# EAGLE design AnalogConversion_v1 (EAGLE 9.6.2)

## Sheet 1 of 6: MAIN
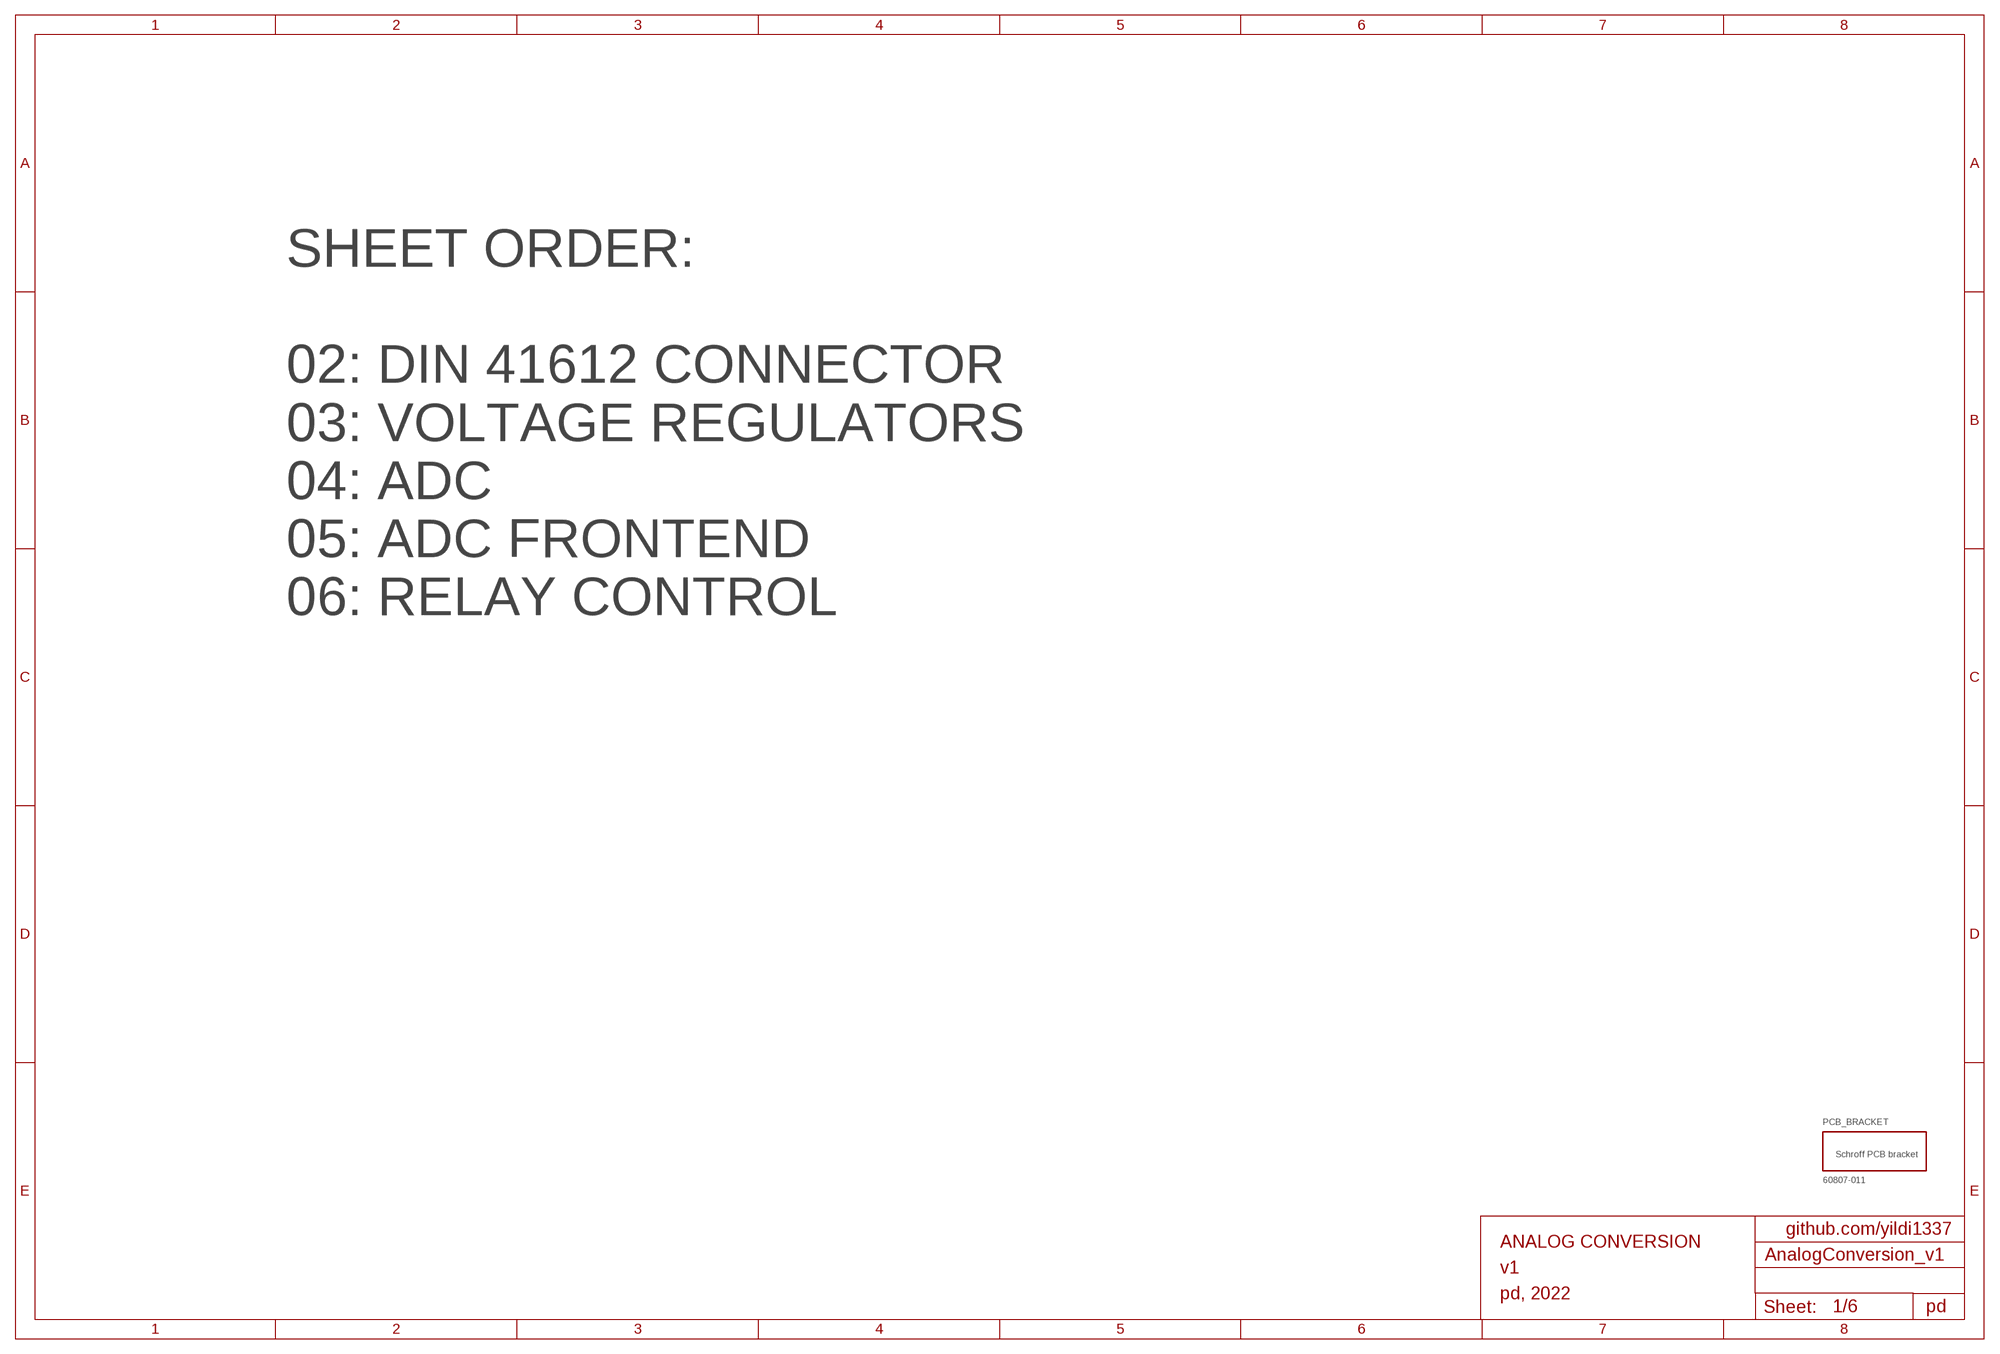
[diagram p0: schematic, sheet 1]

### Parts
PCB_BRACKET  60807-011  [60807-011]

### Notes on the sheet
- SHEET ORDER:
  
  02: DIN 41612 CONNECTOR
  03: VOLTAGE REGULATORS
  04: ADC
  05: ADC FRONTEND
  06: RELAY CONTROL
- github.com/yildi1337
- ANALOG CONVERSION
- v1
- pd, 2022
- pd

## Sheet 2 of 6: DIN 41612 CONNECTOR
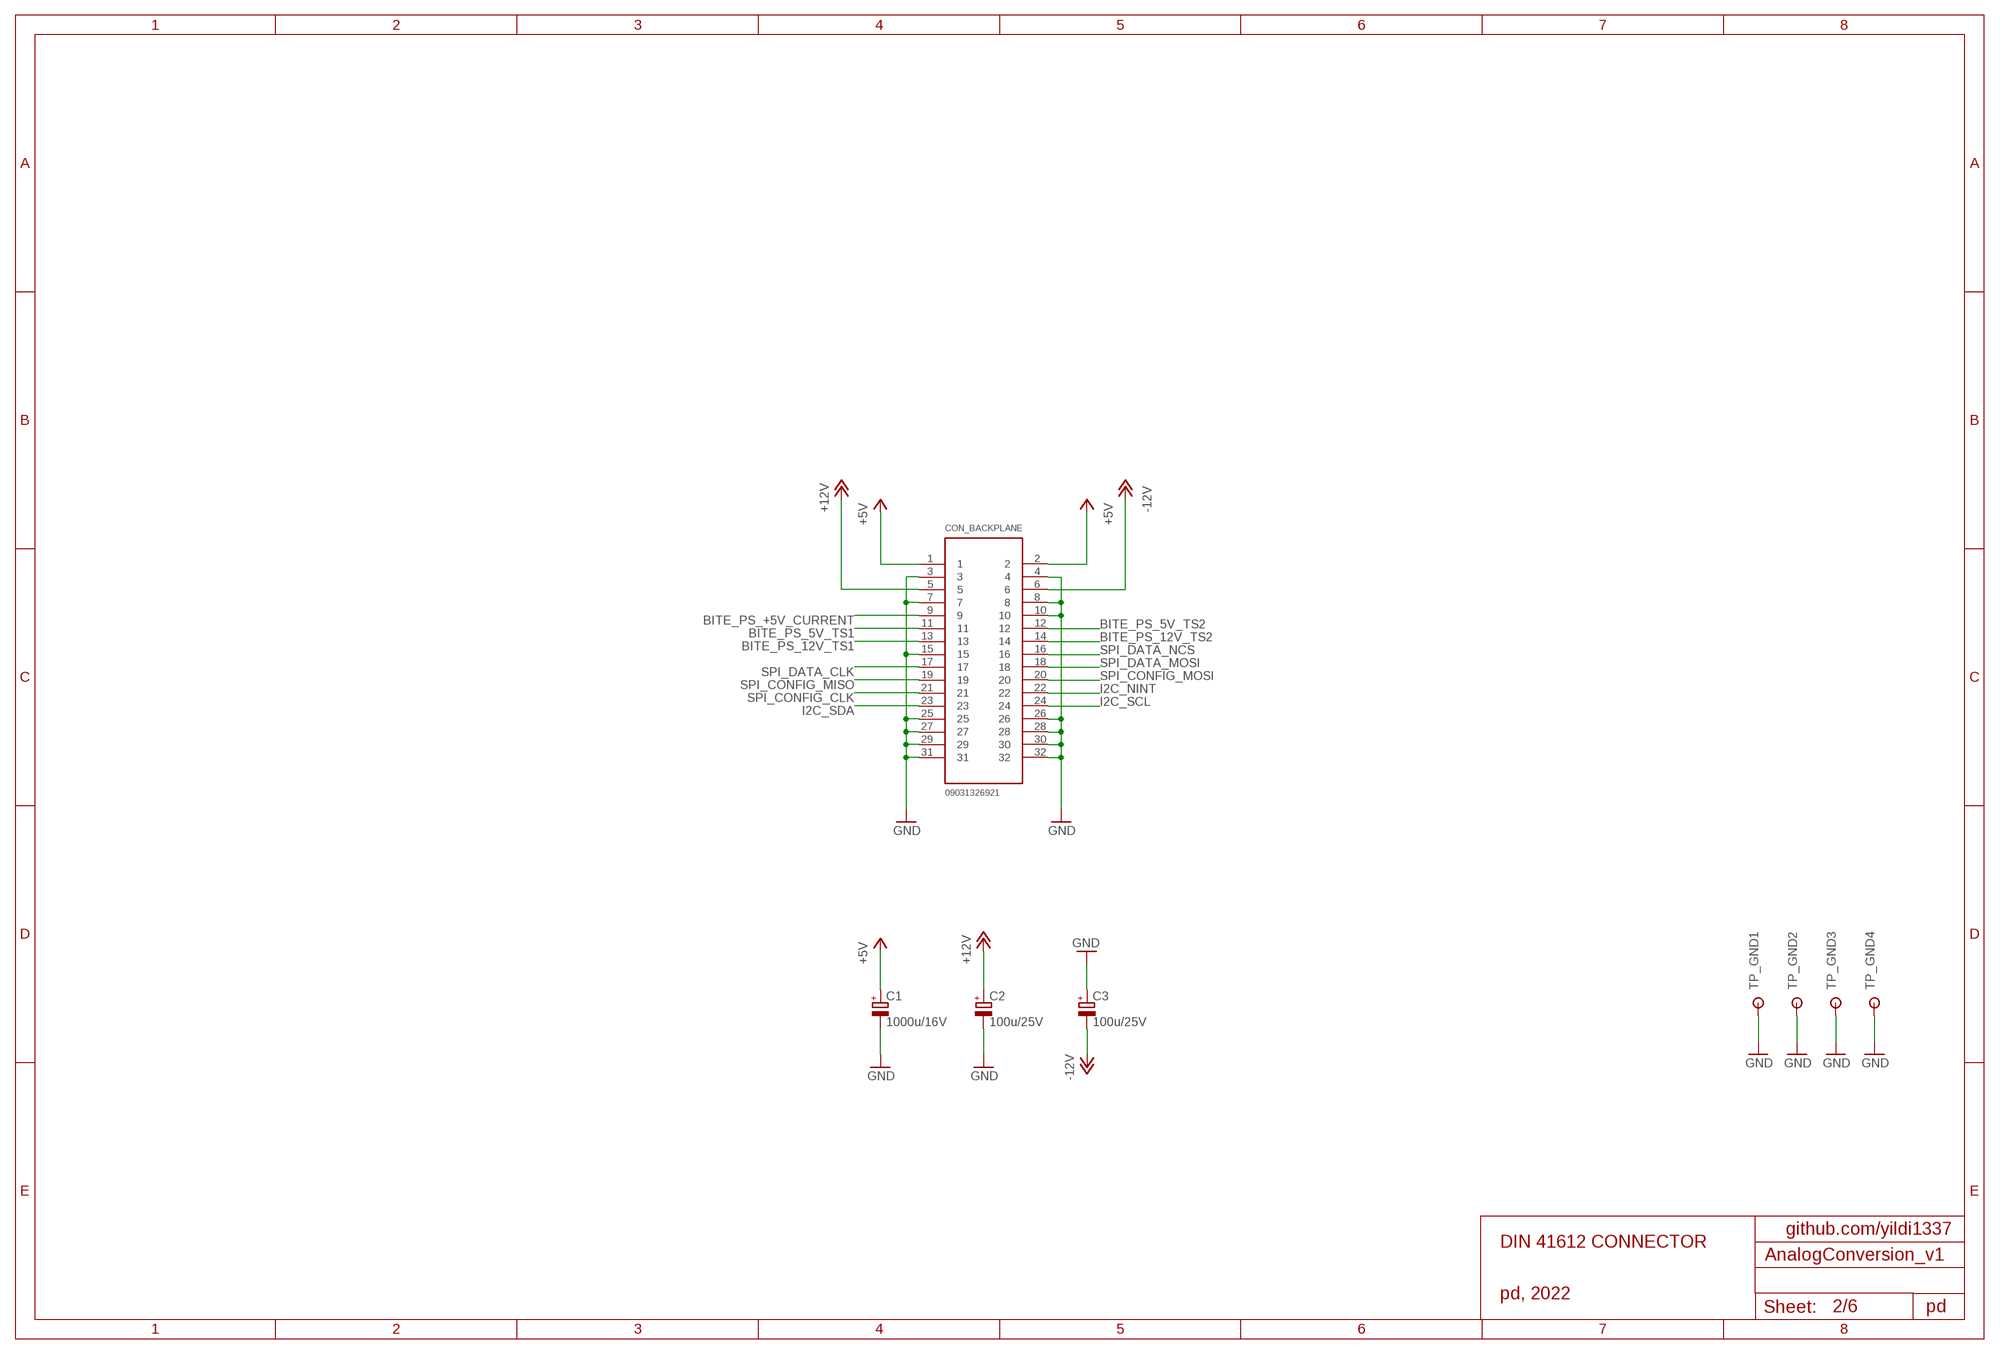
[diagram p1: schematic, sheet 2]

### Parts
C1  1000u/16V  CPOL-EU153CLV-1010  [153CLV-1010]
C2  100u/25V  CPOL-EU153CLV-0810  [153CLV-0810]
C3  100u/25V  CPOL-EU153CLV-0810  [153CLV-0810]
CON_BACKPLANE  09031326921  [09031326921]
TP_GND1  RSPRO-1MM-TERMINAL-POST-2622034  [RSPRO-1MM-TERMINAL-POST-2622034]
TP_GND2  RSPRO-1MM-TERMINAL-POST-2622034  [RSPRO-1MM-TERMINAL-POST-2622034]
TP_GND3  RSPRO-1MM-TERMINAL-POST-2622034  [RSPRO-1MM-TERMINAL-POST-2622034]
TP_GND4  RSPRO-1MM-TERMINAL-POST-2622034  [RSPRO-1MM-TERMINAL-POST-2622034]

### Nets
+5V: C1.+ CON_BACKPLANE.1 CON_BACKPLANE.2 ; also sheet 3,5,6
+12V: C2.+ CON_BACKPLANE.5 ; also sheet 3
-12V: C3.- CON_BACKPLANE.6 ; also sheet 3
BITE_PS_5V_TS1: CON_BACKPLANE.11
BITE_PS_5V_TS2: CON_BACKPLANE.12
BITE_PS_12V_TS1: CON_BACKPLANE.13
BITE_PS_12V_TS2: CON_BACKPLANE.14
BITE_PS_+5V_CURRENT: CON_BACKPLANE.9
GND: C1.- C2.- C3.+ CON_BACKPLANE.3 CON_BACKPLANE.4 CON_BACKPLANE.7 CON_BACKPLANE.8 CON_BACKPLANE.10 CON_BACKPLANE.15 CON_BACKPLANE.25 CON_BACKPLANE.26 CON_BACKPLANE.27 CON_BACKPLANE.28 CON_BACKPLANE.29 CON_BACKPLANE.30 CON_BACKPLANE.31 CON_BACKPLANE.32 TP_GND1.P$1 TP_GND2.P$1 TP_GND3.P$1 TP_GND4.P$1 ; also sheet 3,4,5,6
I2C_NINT: CON_BACKPLANE.22 ; also sheet 6
I2C_SCL: CON_BACKPLANE.24 ; also sheet 6
I2C_SDA: CON_BACKPLANE.23 ; also sheet 6
SPI_CONFIG_CLK: CON_BACKPLANE.21 ; also sheet 4,6
SPI_CONFIG_MISO: CON_BACKPLANE.19 ; also sheet 4,6
SPI_CONFIG_MOSI: CON_BACKPLANE.20 ; also sheet 4,6
SPI_DATA_CLK: CON_BACKPLANE.17 ; also sheet 4
SPI_DATA_MOSI: CON_BACKPLANE.18 ; also sheet 4
SPI_DATA_NCS: CON_BACKPLANE.16 ; also sheet 4

### Notes on the sheet
- github.com/yildi1337
- DIN 41612 CONNECTOR
- pd, 2022
- pd

## Sheet 3 of 6: VOLTAGE REGULATORS
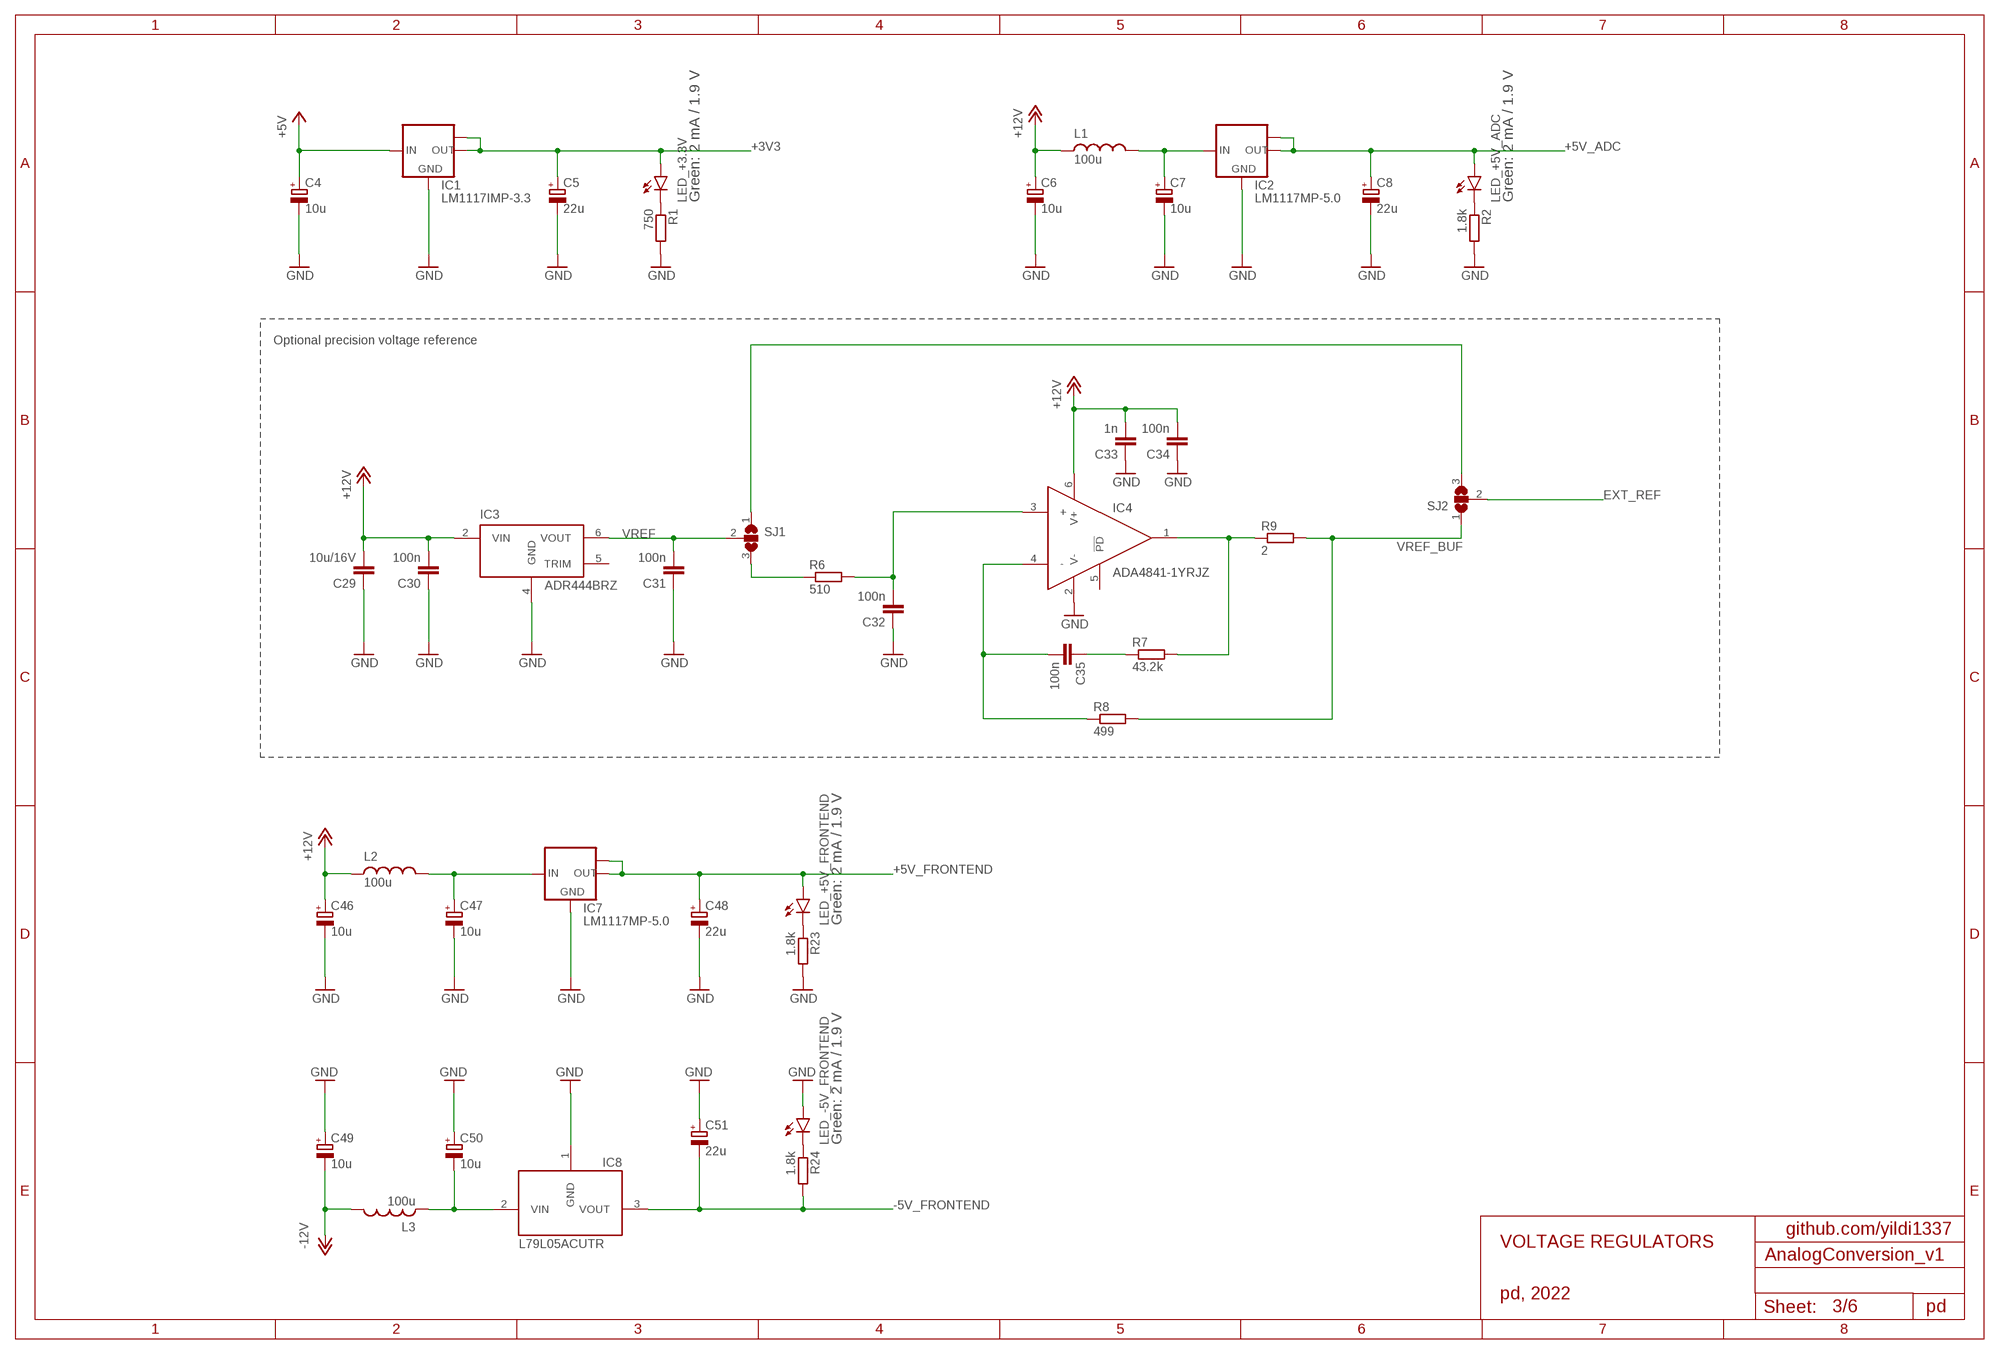
[diagram p2: schematic, sheet 3]

### Parts
C4  10u  CPOL-EUCT3216  [CT3216]
C5  22u  CPOL-EUCT6032  [CT6032]
C6  10u  CPOL-EUCT3216  [CT3216]
C7  10u  CPOL-EUCT3216  [CT3216]
C8  22u  CPOL-EUCT6032  [CT6032]
C29  10u/16V  C-EUC0805  [C0805]
C30  100n  C-EUC0603  [C0603]
C31  100n  C-EUC0603  [C0603]
C32  100n  C-EUC0603  [C0603]
C33  1n  C-EUC0603  [C0603]
C34  100n  C-EUC0603  [C0603]
C35  100n  C-EUC0603  [C0603]
C46  10u  CPOL-EUCT3216  [CT3216]
C47  10u  CPOL-EUCT3216  [CT3216]
C48  22u  CPOL-EUCT6032  [CT6032]
C49  10u  CPOL-EUCT3216  [CT3216]
C50  10u  CPOL-EUCT3216  [CT3216]
C51  22u  CPOL-EUCT6032  [CT6032]
IC1  LM1117IMP-3.3  LM1117IMPX-3.3  [SOT223]
IC2  LM1117MP-5.0  LM1117MPX-5.0  [SOT223]
IC3  ADR444BRZ  [ADR444BRZ]
IC4  ADA4841-1YRJZ  [ADA4841-1YRJZ]
IC7  LM1117MP-5.0  LM1117MPX-5.0  [SOT223]
IC8  L79L05ACUTR  [L79L05ACUTR]
L1  100u  VLS6045AF-101M  [VLS6045AF-101M]
L2  100u  VLS6045AF-101M  [VLS6045AF-101M]
L3  100u  VLS6045AF-101M  [VLS6045AF-101M]
LED_+3.3V  LEDCHIP-LED0603  [CHIP-LED0603]
LED_+5V_ADC  LEDCHIP-LED0603  [CHIP-LED0603]
LED_+5V_FRONTEND  LEDCHIP-LED0603  [CHIP-LED0603]
LED_-5V_FRONTEND  LEDCHIP-LED0603  [CHIP-LED0603]
R1  750  R-EU_R0603  [R0603]
R2  1.8k  R-EU_R0603  [R0603]
R6  510  R-EU_R0603  [R0603]
R7  43.2k  R-EU_R0603  [R0603]
R8  499  R-EU_R0603  [R0603]
R9  2  R-EU_R0603  [R0603]
R23  1.8k  R-EU_R0603  [R0603]
R24  1.8k  R-EU_R0603  [R0603]
SJ1  SJ2W  [SJ_2]
SJ2  SJ2W  [SJ_2]

### Nets
+3V3: C5.+ IC1.2(OUT) IC1.TAB(OUT1) LED_+3.3V.A ; also sheet 4,6
+5V: C4.+ IC1.3(IN) ; also sheet 2,5,6
+5V_ADC: C8.+ IC2.2(OUT) IC2.TAB(OUT1) LED_+5V_ADC.A ; also sheet 4
+5V_FRONTEND: C48.+ IC7.2(OUT) IC7.TAB(OUT1) LED_+5V_FRONTEND.A ; also sheet 5
+12V: C6.+ C29.2 C30.2 C33.2 C34.2 C46.+ IC3.2(VIN) IC4.6(V+) L1.1 L2.1 ; also sheet 2
-5V_FRONTEND: C51.- IC8.3(VOUT) R24.2 ; also sheet 5
-12V: C49.- L3.2 ; also sheet 2
EXT_REF: SJ2.2 ; also sheet 4
GND: C4.- C5.- C6.- C7.- C8.- C29.1 C30.1 C31.1 C32.1 C33.1 C34.1 C46.- C47.- C48.- C49.+ C50.+ C51.+ IC1.1(GND) IC2.1(GND) IC3.4(GND) IC4.2(V-) IC7.1(GND) IC8.1(GND) LED_-5V_FRONTEND.A R1.2 R2.2 R23.2 ; also sheet 2,4,5,6
N$1: R6.1 SJ1.3
N$2: C32.2 IC4.3(+) R6.2
N$3: IC4.1(VOUT) R7.2 R9.1
N$4: C7.+ IC2.3(IN) L1.2
N$5: SJ1.1 SJ2.3
N$6: C35.1 R7.1
N$7: C35.2 IC4.4(-) R8.1
N$12: LED_+5V_FRONTEND.C R23.1
N$13: C47.+ IC7.3(IN) L2.2
N$15: C50.- IC8.2(VIN) L3.1
N$23: LED_-5V_FRONTEND.C R24.1
N$49: LED_+3.3V.C R1.1
N$50: LED_+5V_ADC.C R2.1
VREF: C31.2 IC3.6(VOUT) SJ1.2
VREF_BUF: R8.2 R9.2 SJ2.1
Unconnected: IC3.5(TRIM) IC4.5(!PD)

### Notes on the sheet
- Green: 2 mA / 1.9 V | Green: 2 mA / 1.9 V
- Optional precision voltage reference
- Green: 2 mA / 1.9 V
- Green: 2 mA / 1.9 V
- github.com/yildi1337
- VOLTAGE REGULATORS
- pd, 2022
- pd

## Sheet 4 of 6: ADC
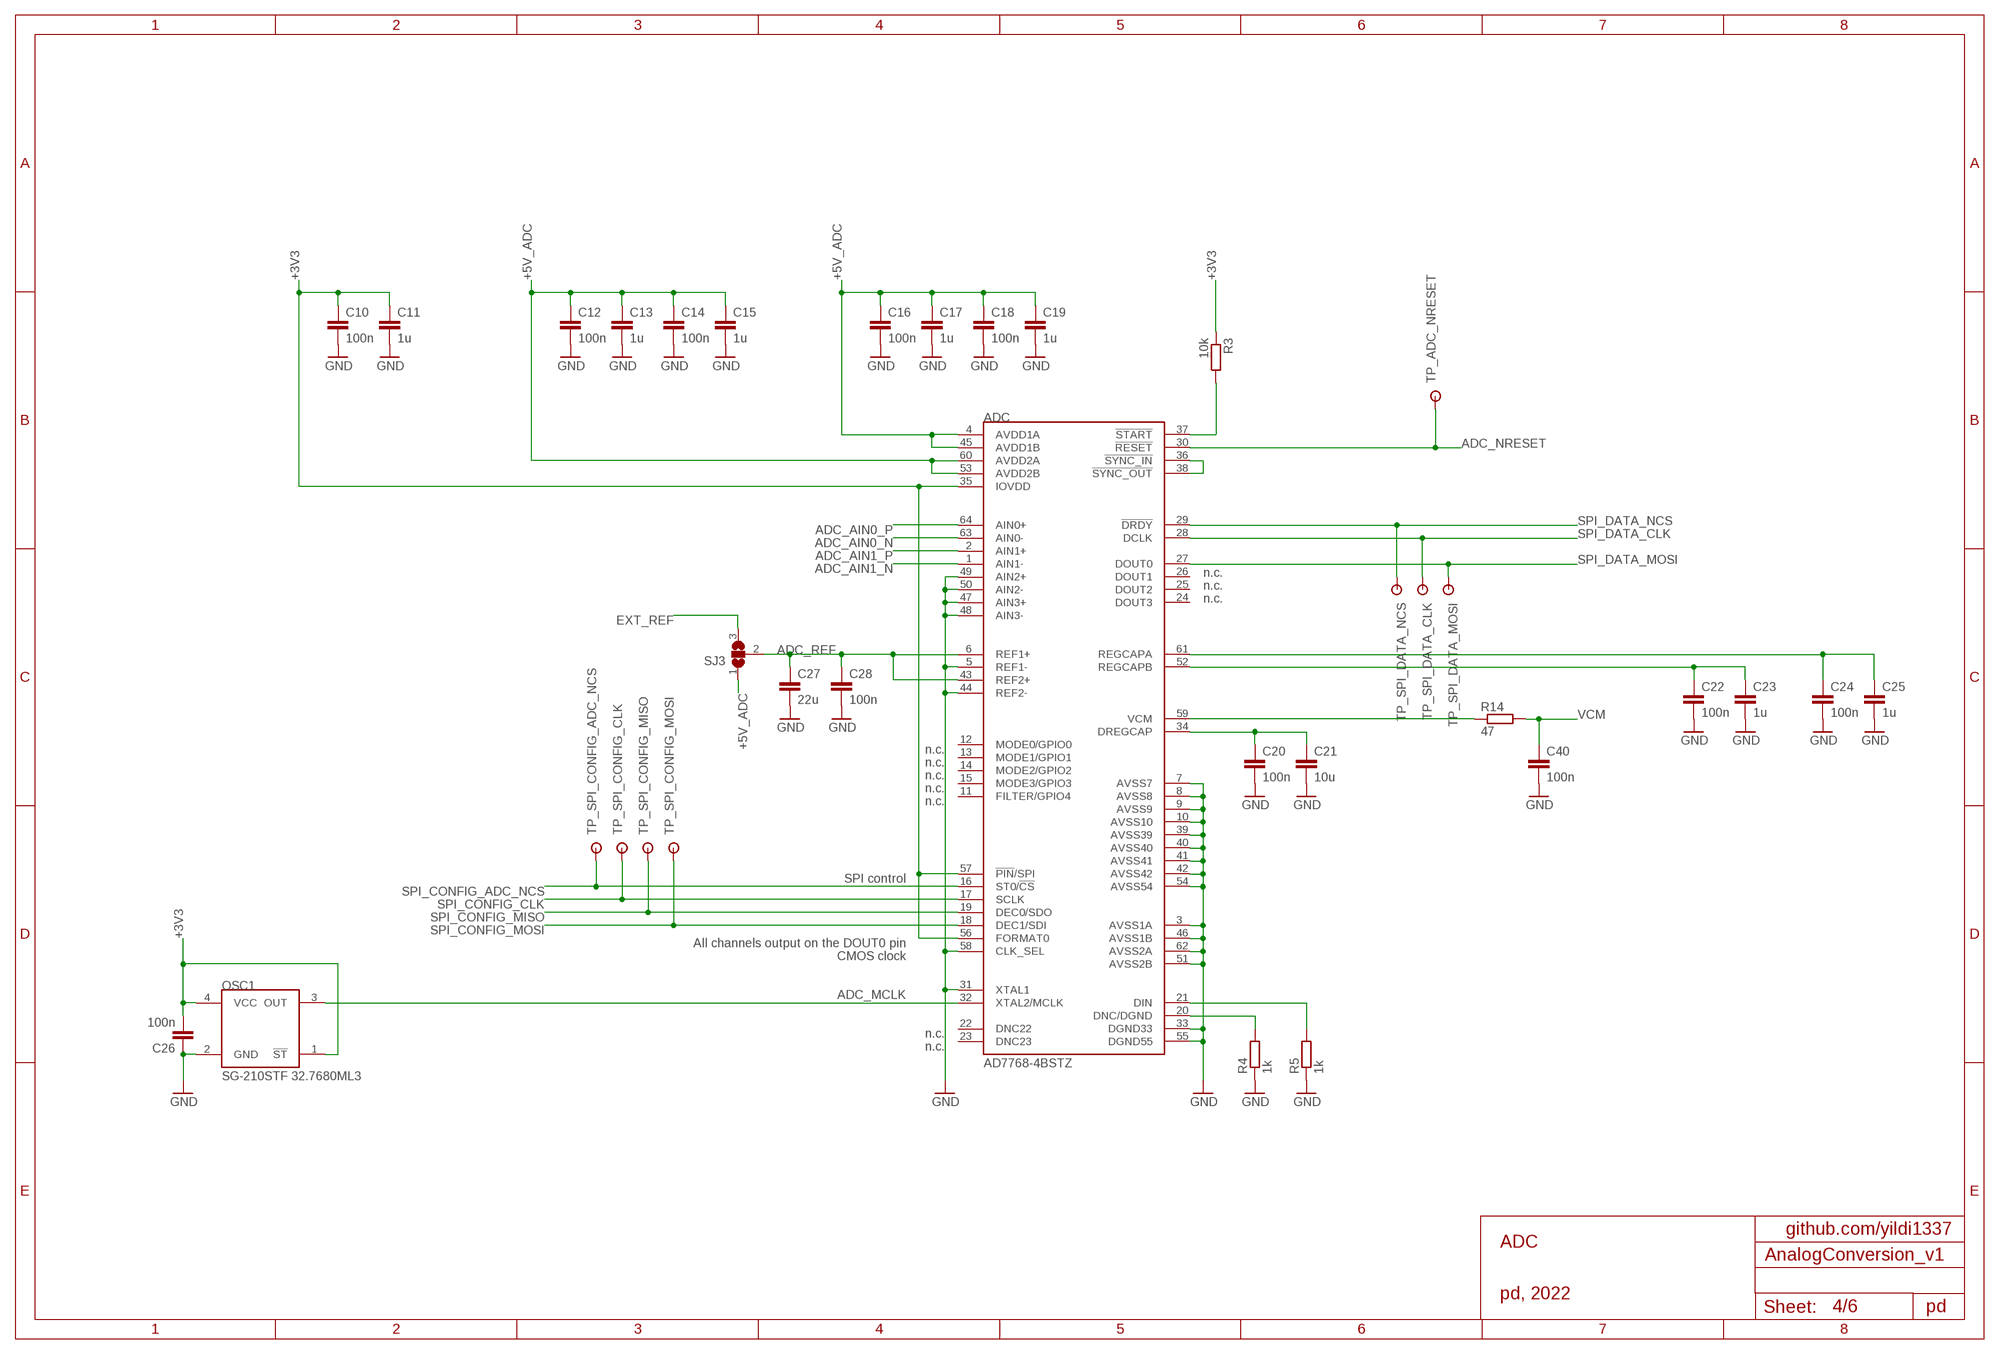
[diagram p3: schematic, sheet 4]

### Parts
ADC  AD7768-4BSTZ  [AD7768-4BSTZ]
C10  100n  C-EUC0603  [C0603]
C11  1u  C-EUC0603  [C0603]
C12  100n  C-EUC0603  [C0603]
C13  1u  C-EUC0603  [C0603]
C14  100n  C-EUC0603  [C0603]
C15  1u  C-EUC0603  [C0603]
C16  100n  C-EUC0603  [C0603]
C17  1u  C-EUC0603  [C0603]
C18  100n  C-EUC0603  [C0603]
C19  1u  C-EUC0603  [C0603]
C20  100n  C-EUC0603  [C0603]
C21  10u  C-EUC0603  [C0603]
C22  100n  C-EUC0603  [C0603]
C23  1u  C-EUC0603  [C0603]
C24  100n  C-EUC0603  [C0603]
C25  1u  C-EUC0603  [C0603]
C26  100n  C-EUC0603  [C0603]
C27  22u  C-EUC1206  [C1206]
C28  100n  C-EUC0603  [C0603]
C40  100n  C-EUC0603  [C0603]
OSC1  SG-210STF 32.7680ML3  SG-210STF-32.7680ML3  [SG-210STF-32.7680ML3]
R3  10k  R-EU_R0603  [R0603]
R4  1k  R-EU_R0603  [R0603]
R5  1k  R-EU_R0603  [R0603]
R14  47  R-EU_R0603  [R0603]
SJ3  SJ2W  [SJ_2]
TP_ADC_NRESET  RSPRO-1MM-TERMINAL-POST-2622034  [RSPRO-1MM-TERMINAL-POST-2622034]
TP_SPI_CONFIG_ADC_NCS  RSPRO-1MM-TERMINAL-POST-2622034  [RSPRO-1MM-TERMINAL-POST-2622034]
TP_SPI_CONFIG_CLK  RSPRO-1MM-TERMINAL-POST-2622034  [RSPRO-1MM-TERMINAL-POST-2622034]
TP_SPI_CONFIG_MISO  RSPRO-1MM-TERMINAL-POST-2622034  [RSPRO-1MM-TERMINAL-POST-2622034]
TP_SPI_CONFIG_MOSI  RSPRO-1MM-TERMINAL-POST-2622034  [RSPRO-1MM-TERMINAL-POST-2622034]
TP_SPI_DATA_CLK  RSPRO-1MM-TERMINAL-POST-2622034  [RSPRO-1MM-TERMINAL-POST-2622034]
TP_SPI_DATA_MOSI  RSPRO-1MM-TERMINAL-POST-2622034  [RSPRO-1MM-TERMINAL-POST-2622034]
TP_SPI_DATA_NCS  RSPRO-1MM-TERMINAL-POST-2622034  [RSPRO-1MM-TERMINAL-POST-2622034]

### Nets
+3V3: ADC.35(IOVDD) ADC.56(FORMAT0) ADC.57(!PIN!/SPI) C10.1 C11.1 C26.2 OSC1.1(!ST) OSC1.4(VCC) R3.1 ; also sheet 3,6
+5V_ADC: ADC.4(AVDD1A) ADC.45(AVDD1B) ADC.53(AVDD2B) ADC.60(AVDD2A) C12.1 C13.1 C14.1 C15.1 C16.1 C17.1 C18.1 C19.1 SJ3.1 ; also sheet 3
ADC_AIN0_N: ADC.63(AIN0-) ; also sheet 5
ADC_AIN0_P: ADC.64(AIN0+) ; also sheet 5
ADC_AIN1_N: ADC.1(AIN1-) ; also sheet 5
ADC_AIN1_P: ADC.2(AIN1+) ; also sheet 5
ADC_MCLK: ADC.32(XTAL2/MCLK) OSC1.3(OUT)
ADC_NRESET: ADC.30(!RESET!) TP_ADC_NRESET.P$1 ; also sheet 6
ADC_REF: ADC.6(REF1+) ADC.43(REF2+) C27.1 C28.1 SJ3.2
DIN: ADC.21(DIN) R5.2
DREGCAP: ADC.34(DREGCAP) C20.1 C21.1
EXT_REF: SJ3.3 ; also sheet 3
GND: ADC.3(AVSS1A) ADC.5(REF1-) ADC.7(AVSS7) ADC.8(AVSS8) ADC.9(AVSS9) ADC.10(AVSS10) ADC.31(XTAL1) ADC.33(DGND33) ADC.39(AVSS39) ADC.40(AVSS40) ADC.41(AVSS41) ADC.42(AVSS42) ADC.44(REF2-) ADC.46(AVSS1B) ADC.47(AIN3+) ADC.48(AIN3-) ADC.49(AIN2+) ADC.50(AIN2-) ADC.51(AVSS2B) ADC.54(AVSS54) ADC.55(DGND55) ADC.58(CLK_SEL) ADC.62(AVSS2A) C10.2 C11.2 C12.2 C13.2 C14.2 C15.2 C16.2 C17.2 C18.2 C19.2 C20.2 C21.2 C22.2 C23.2 C24.2 C25.2 C26.1 C27.2 C28.2 C40.2 OSC1.2(GND) R4.1 R5.1 ; also sheet 2,3,5,6
N$11: ADC.59(VCM) R14.1
N$48: ADC.20(DNC/DGND) R4.2
N$78: ADC.36(!SYNC_IN!) ADC.38(!SYNC_OUT!)
N$81: ADC.37(!START!) R3.2
REGCAPA: ADC.61(REGCAPA) C24.1 C25.1
REGCAPB: ADC.52(REGCAPB) C22.1 C23.1
SPI_CONFIG_ADC_NCS: ADC.16(ST0/!CS!) TP_SPI_CONFIG_ADC_NCS.P$1 ; also sheet 6
SPI_CONFIG_CLK: ADC.17(SCLK) TP_SPI_CONFIG_CLK.P$1 ; also sheet 2,6
SPI_CONFIG_MISO: ADC.19(DEC0/SDO) TP_SPI_CONFIG_MISO.P$1 ; also sheet 2,6
SPI_CONFIG_MOSI: ADC.18(DEC1/SDI) TP_SPI_CONFIG_MOSI.P$1 ; also sheet 2,6
SPI_DATA_CLK: ADC.28(DCLK) TP_SPI_DATA_CLK.P$1 ; also sheet 2
SPI_DATA_MOSI: ADC.27(DOUT0) TP_SPI_DATA_MOSI.P$1 ; also sheet 2
SPI_DATA_NCS: ADC.29(!DRDY!) TP_SPI_DATA_NCS.P$1 ; also sheet 2
VCM: C40.1 R14.2 ; also sheet 5
Unconnected: ADC.11(FILTER/GPIO4) ADC.12(MODE0/GPIO0) ADC.13(MODE1/GPIO1) ADC.14(MODE2/GPIO2) ADC.15(MODE3/GPIO3) ADC.22(DNC22) ADC.23(DNC23) ADC.24(DOUT3) ADC.25(DOUT2) ADC.26(DOUT1)

### Notes on the sheet
- n.c.
- n.c.
- n.c.
- n.c.
- n.c.
- n.c.
- n.c.
- n.c.
- SPI control
- All channels output on the DOUT0 pin
- CMOS clock
- n.c.
- n.c.
- github.com/yildi1337
- ADC
- pd, 2022
- pd

## Sheet 5 of 6: ADC FRONTEND
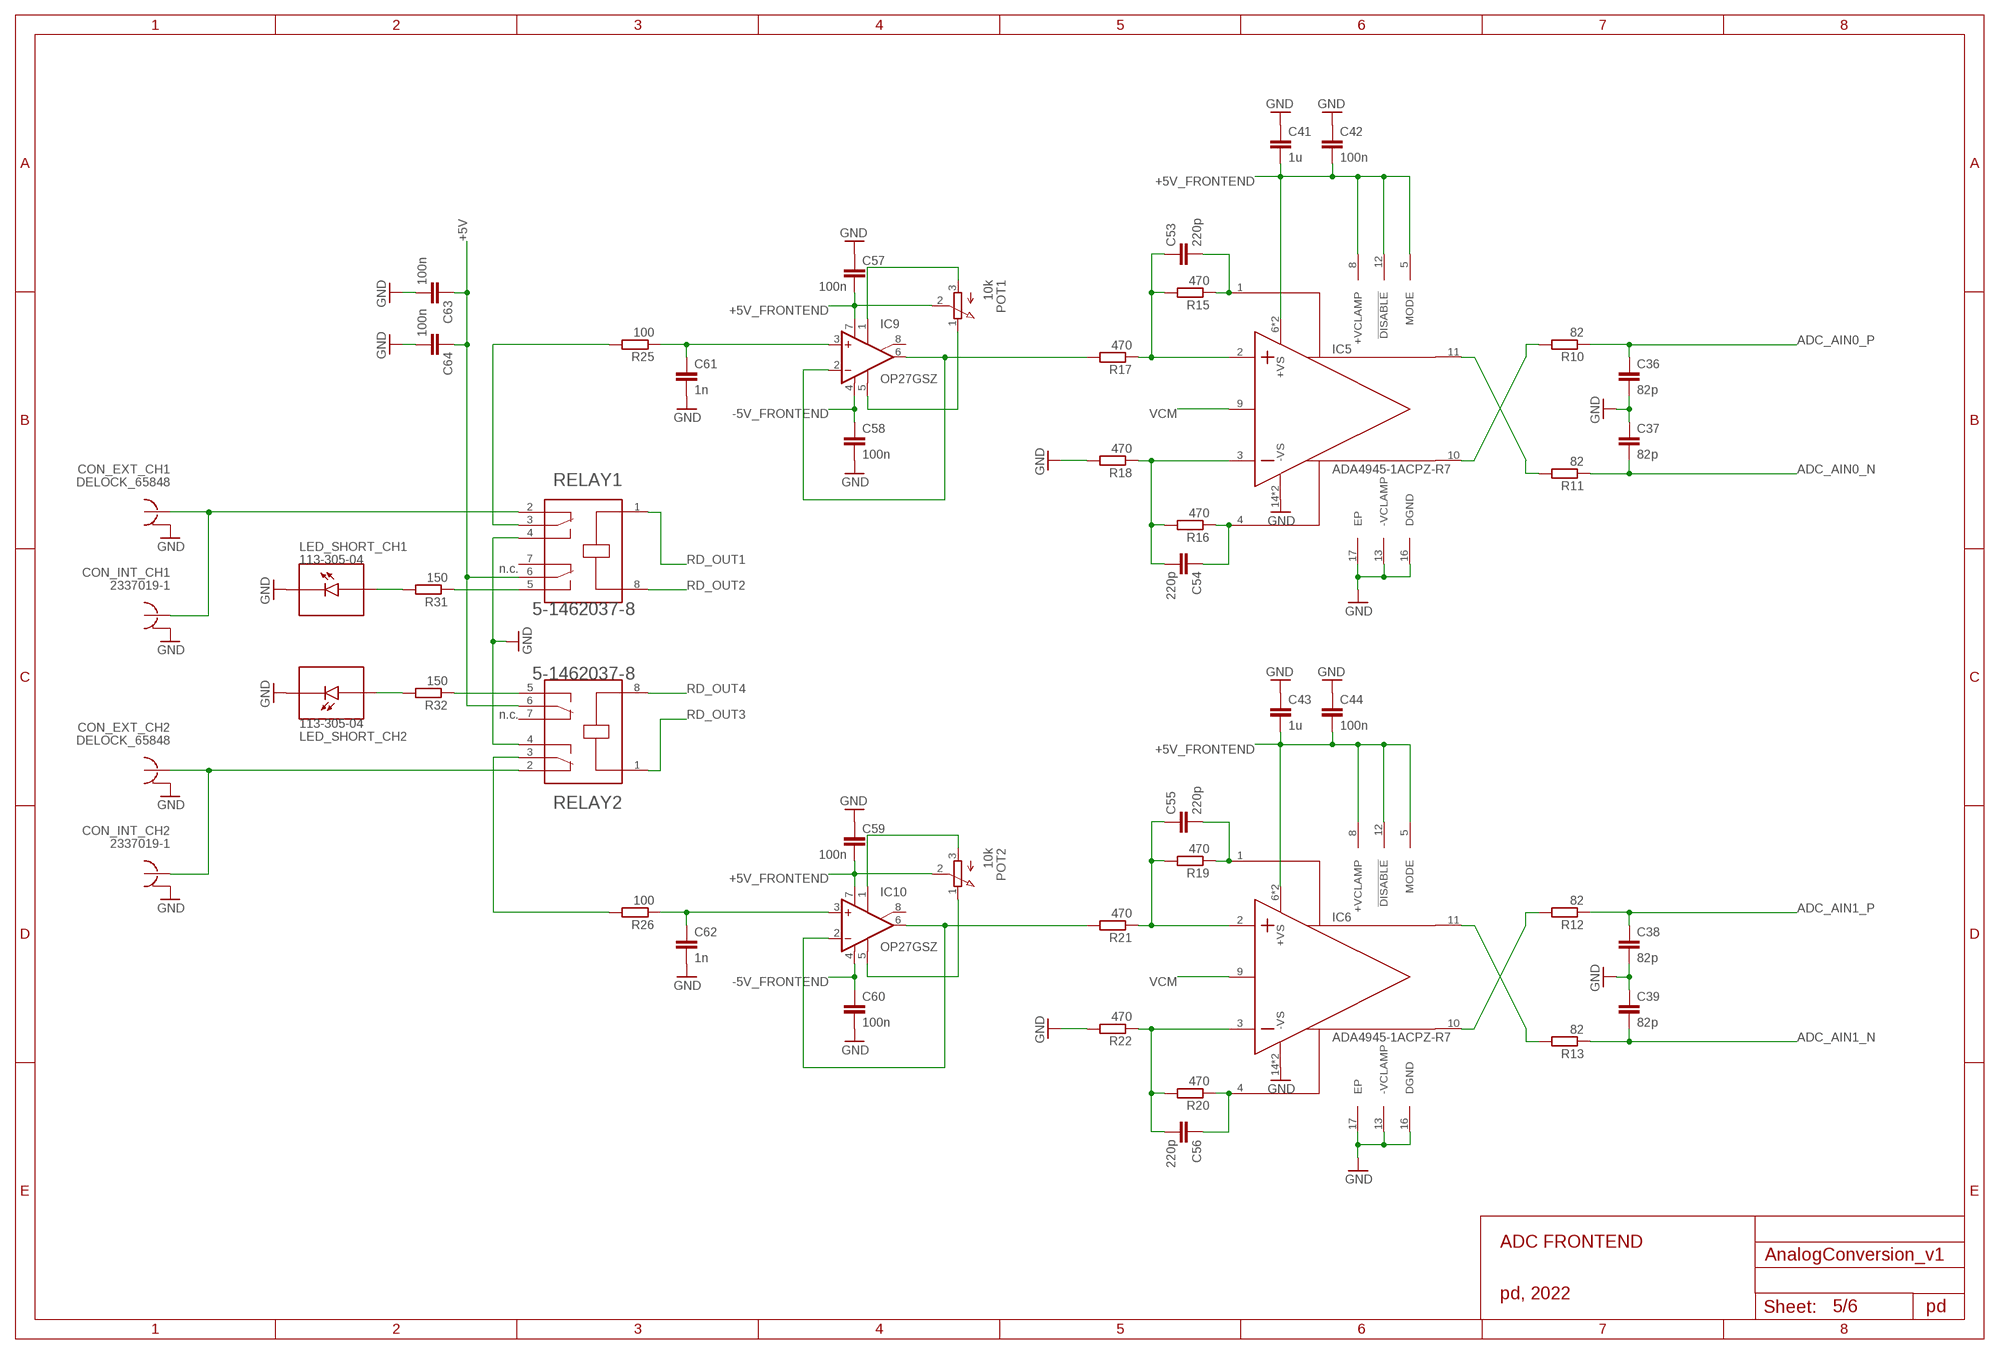
[diagram p4: schematic, sheet 5]

### Parts
C36  82p  C-EUC0603  [C0603]
C37  82p  C-EUC0603  [C0603]
C38  82p  C-EUC0603  [C0603]
C39  82p  C-EUC0603  [C0603]
C41  1u  C-EUC0603  [C0603]
C42  100n  C-EUC0603  [C0603]
C43  1u  C-EUC0603  [C0603]
C44  100n  C-EUC0603  [C0603]
C53  220p  C-EUC0603  [C0603]
C54  220p  C-EUC0603  [C0603]
C55  220p  C-EUC0603  [C0603]
C56  220p  C-EUC0603  [C0603]
C57  100n  C-EUC0603  [C0603]
C58  100n  C-EUC0603  [C0603]
C59  100n  C-EUC0603  [C0603]
C60  100n  C-EUC0603  [C0603]
C61  1n  C-EUC0603  [C0603]
C62  1n  C-EUC0603  [C0603]
C63  100n  C-EUC0603  [C0603]
C64  100n  C-EUC0603  [C0603]
CON_EXT_CH1  DELOCK_65848  [DELOCK_65848]
CON_EXT_CH2  DELOCK_65848  [DELOCK_65848]
CON_INT_CH1  2337019-1  [2337019-1]
CON_INT_CH2  2337019-1  [2337019-1]
IC5  ADA4945-1ACPZ-R7  [ADA4945-1ACPZ-R7]
IC6  ADA4945-1ACPZ-R7  [ADA4945-1ACPZ-R7]
IC9  OP27GSZ  OP27D  [SO08]
IC10  OP27GSZ  OP27D  [SO08]
LED_SHORT_CH1  113-305-04  [113-305-04]
LED_SHORT_CH2  113-305-04  [113-305-04]
POT1  10k  3296W  [3296W]
POT2  10k  3296W  [3296W]
R10  82  R-EU_R0603  [R0603]
R11  82  R-EU_R0603  [R0603]
R12  82  R-EU_R0603  [R0603]
R13  82  R-EU_R0603  [R0603]
R15  470  R-EU_R0603  [R0603]
R16  470  R-EU_R0603  [R0603]
R17  470  R-EU_R0603  [R0603]
R18  470  R-EU_R0603  [R0603]
R19  470  R-EU_R0603  [R0603]
R20  470  R-EU_R0603  [R0603]
R21  470  R-EU_R0603  [R0603]
R22  470  R-EU_R0603  [R0603]
R25  100  R-EU_R0603  [R0603]
R26  100  R-EU_R0603  [R0603]
R31  150  R-EU_R0603  [R0603]
R32  150  R-EU_R0603  [R0603]
RELAY1  5-1462037-8  [5-1462037-8]
RELAY2  5-1462037-8  [5-1462037-8]

### Nets
+5V: C63.1 C64.1 RELAY1.6 RELAY2.6 ; also sheet 2,3,6
+5V_FRONTEND: C41.2 C42.2 C43.2 C44.2 C57.2 C59.2 IC5.5(MODE) IC5.6(+VS) IC5.7(+VS) IC5.8(+VCLAMP) IC5.12(!DISABLE) IC6.5(MODE) IC6.6(+VS) IC6.7(+VS) IC6.8(+VCLAMP) IC6.12(!DISABLE) IC9.7(V+) IC10.7(V+) POT1.2 POT2.2 ; also sheet 3
-5V_FRONTEND: C58.1 C60.1 IC9.4(V-) IC10.4(V-) ; also sheet 3
ADC_AIN0_N: C37.2 R11.1 ; also sheet 4
ADC_AIN0_P: C36.1 R10.1 ; also sheet 4
ADC_AIN1_N: C39.2 R13.1 ; also sheet 4
ADC_AIN1_P: C38.1 R12.1 ; also sheet 4
GND: C36.2 C37.1 C38.2 C39.1 C41.1 C42.1 C43.1 C44.1 C57.1 C58.2 C59.1 C60.2 C61.2 C62.2 C63.2 C64.2 CON_EXT_CH1.G1(G) CON_EXT_CH1.G2(G) CON_EXT_CH1.G3(G) CON_EXT_CH1.G4(G) CON_EXT_CH2.G1(G) CON_EXT_CH2.G2(G) CON_EXT_CH2.G3(G) CON_EXT_CH2.G4(G) CON_INT_CH1.G1(GND) CON_INT_CH1.G2(GND) CON_INT_CH2.G1(GND) CON_INT_CH2.G2(GND) IC5.13(-VCLAMP) IC5.14(-VS) IC5.15(-VS) IC5.16(DGND) IC5.17(EP) IC6.13(-VCLAMP) IC6.14(-VS) IC6.15(-VS) IC6.16(DGND) IC6.17(EP) LED_SHORT_CH1.-(C) LED_SHORT_CH2.-(C) R18.2 R22.2 RELAY1.4 RELAY2.4 ; also sheet 2,3,4,6
N$8: IC6.10(+OUT) R12.2
N$9: IC5.10(+OUT) R10.2
N$10: IC5.11(-OUT) R11.2
N$14: IC6.11(-OUT) R13.2
N$16: C53.1 IC5.2(+IN) R15.2 R17.1
N$17: C53.2 IC5.1(-FB) R15.1
N$18: C54.1 IC5.4(+FB) R16.1
N$19: C54.2 IC5.3(-IN) R16.2 R18.1
N$20: C61.1 IC9.3(+IN) R25.1
N$21: C55.1 IC6.2(+IN) R19.2 R21.1
N$22: C55.2 IC6.1(-FB) R19.1
N$24: C56.2 IC6.3(-IN) R20.2 R22.1
N$25: C56.1 IC6.4(+FB) R20.1
N$26: IC10.2(-IN) IC10.6(OUT) R21.2
N$27: C62.1 IC10.3(+IN) R26.1
N$28: IC9.2(-IN) IC9.6(OUT) R17.2
N$29: R25.2 RELAY1.3
N$30: R26.2 RELAY2.3
N$31: IC9.1(ON1) POT1.3
N$32: IC9.5(OPT) POT1.1
N$33: IC10.1(ON1) POT2.3
N$34: IC10.5(OPT) POT2.1
N$54: CON_EXT_CH1.S CON_INT_CH1.S(SIG) RELAY1.2
N$55: CON_EXT_CH2.S CON_INT_CH2.S(SIG) RELAY2.2
N$56: LED_SHORT_CH1.+(A) R31.2
N$58: LED_SHORT_CH2.+(A) R32.2
N$59: R32.1 RELAY2.5
N$60: R31.1 RELAY1.5
RD_OUT1: RELAY1.1 ; also sheet 6
RD_OUT2: RELAY1.8 ; also sheet 6
RD_OUT3: RELAY2.1 ; also sheet 6
RD_OUT4: RELAY2.8 ; also sheet 6
VCM: IC5.9(VOCM) IC6.9(VOCM) ; also sheet 4
Unconnected: IC9.8(ON2) IC10.8(ON2) RELAY1.7 RELAY2.7

### Notes on the sheet
- n.c.
- n.c.
- ADC FRONTEND
- pd, 2022
- pd

## Sheet 6 of 6: RELAY CONTROL
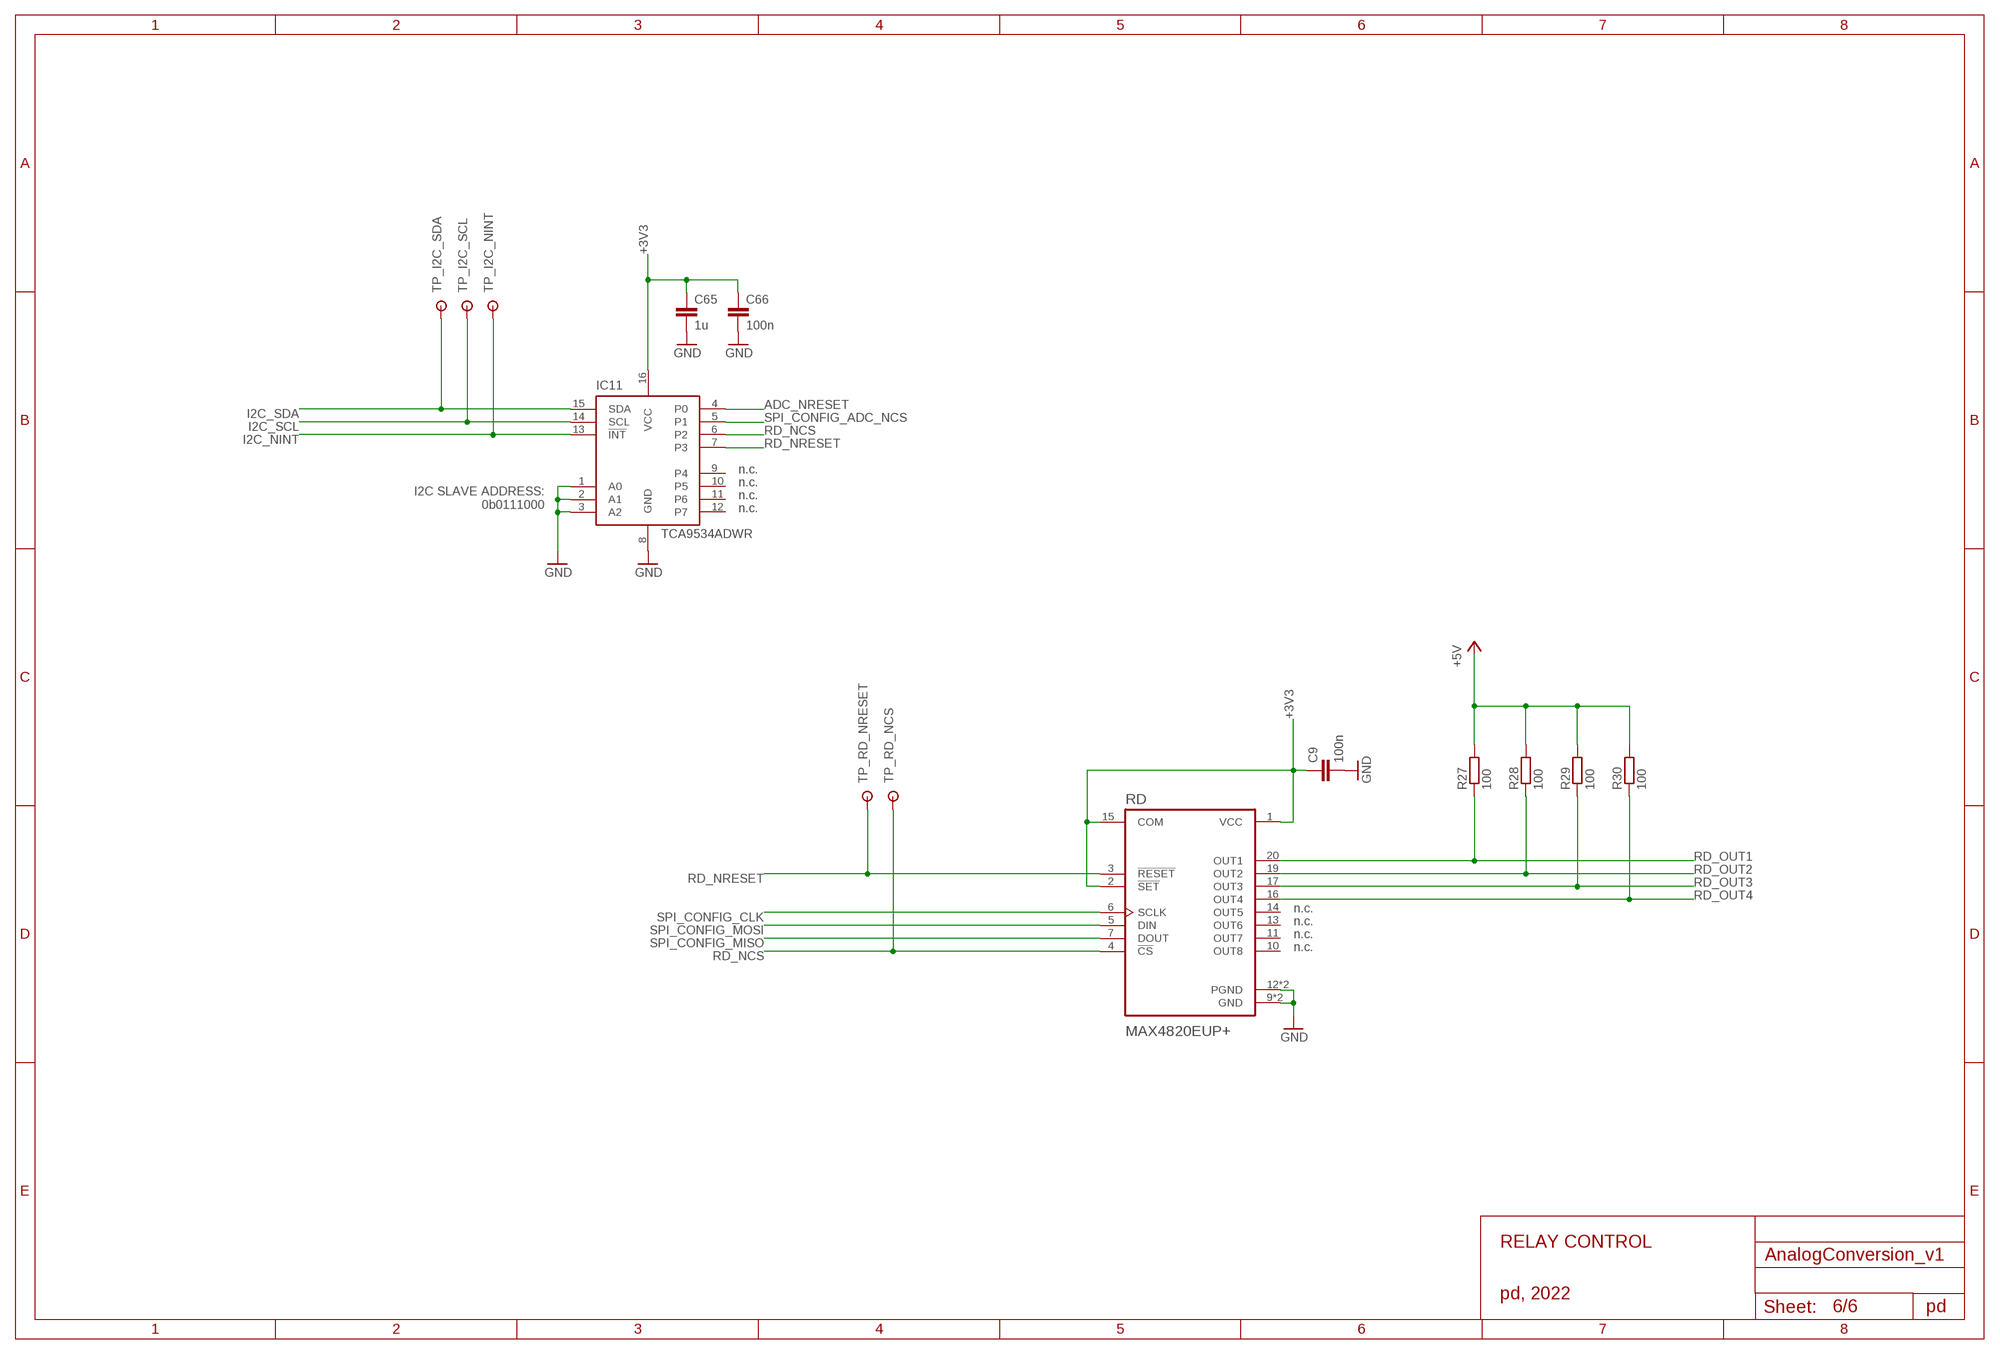
[diagram p5: schematic, sheet 6]

### Parts
C9  100n  C-EUC0603  [C0603]
C65  1u  C-EUC0603  [C0603]
C66  100n  C-EUC0603  [C0603]
IC11  TCA9534ADWR  [TCA9534ADWR]
R27  100  R-EU_R0603  [R0603]
R28  100  R-EU_R0603  [R0603]
R29  100  R-EU_R0603  [R0603]
R30  100  R-EU_R0603  [R0603]
RD  MAX4820EUP+  [MAX4820EUP+]
TP_I2C_NINT  RSPRO-1MM-TERMINAL-POST-2622034  [RSPRO-1MM-TERMINAL-POST-2622034]
TP_I2C_SCL  RSPRO-1MM-TERMINAL-POST-2622034  [RSPRO-1MM-TERMINAL-POST-2622034]
TP_I2C_SDA  RSPRO-1MM-TERMINAL-POST-2622034  [RSPRO-1MM-TERMINAL-POST-2622034]
TP_RD_NCS  RSPRO-1MM-TERMINAL-POST-2622034  [RSPRO-1MM-TERMINAL-POST-2622034]
TP_RD_NRESET  RSPRO-1MM-TERMINAL-POST-2622034  [RSPRO-1MM-TERMINAL-POST-2622034]

### Nets
+3V3: C9.1 C65.1 C66.1 IC11.16(VCC) RD.1(VCC) RD.2(!SET) RD.15(COM) ; also sheet 3,4
+5V: R27.2 R28.2 R29.2 R30.2 ; also sheet 2,3,5
ADC_NRESET: IC11.4(P0) ; also sheet 4
GND: C9.2 C65.2 C66.2 IC11.1(A0) IC11.2(A1) IC11.3(A2) IC11.8(GND) RD.9(GND) RD.12(PGND) RD.18(PGND) RD.21(GND) ; also sheet 2,3,4,5
I2C_NINT: IC11.13(!INT) TP_I2C_NINT.P$1 ; also sheet 2
I2C_SCL: IC11.14(SCL) TP_I2C_SCL.P$1 ; also sheet 2
I2C_SDA: IC11.15(SDA) TP_I2C_SDA.P$1 ; also sheet 2
RD_NCS: IC11.6(P2) RD.4(!CS) TP_RD_NCS.P$1
RD_NRESET: IC11.7(P3) RD.3(!RESET) TP_RD_NRESET.P$1
RD_OUT1: R27.1 RD.20(OUT1) ; also sheet 5
RD_OUT2: R28.1 RD.19(OUT2) ; also sheet 5
RD_OUT3: R29.1 RD.17(OUT3) ; also sheet 5
RD_OUT4: R30.1 RD.16(OUT4) ; also sheet 5
SPI_CONFIG_ADC_NCS: IC11.5(P1) ; also sheet 4
SPI_CONFIG_CLK: RD.6(SCLK) ; also sheet 2,4
SPI_CONFIG_MISO: RD.7(DOUT) ; also sheet 2,4
SPI_CONFIG_MOSI: RD.5(DIN) ; also sheet 2,4
Unconnected: IC11.9(P4) IC11.10(P5) IC11.11(P6) IC11.12(P7) RD.10(OUT8) RD.11(OUT7) RD.13(OUT6) RD.14(OUT5)

### Notes on the sheet
- n.c.
- I2C SLAVE ADDRESS:
  0b0111000
- n.c.
- n.c.
- n.c.
- n.c.
- n.c.
- n.c.
- n.c.
- RELAY CONTROL
- pd, 2022
- pd

## Library data of the parts
ADC = AD7768-4BSTZ:AD7768-4BSTZ
C1-C3 = rcl:CPOL-EU: POLARIZED CAPACITOR, European symbol; SPICEPREFIX: C
C4-C8 C46-C51 = RCL:CPOL-EU: POLARIZED CAPACITOR, European symbol; SPICEPREFIX: C
C9-C44 C53-C66 = RCL:C-EU: CAPACITOR, European symbol; SPICEPREFIX: C
CON_BACKPLANE = 09031326921:09031326921
CON_EXT_CH1 CON_EXT_CH2 = DELOCK_65848:DELOCK_65848
CON_INT_CH1 CON_INT_CH2 = 2337019-1:2337019-1
IC1 = LM1117:LM1117IMPX-*
IC2 IC7 = LM1117:LM1117MPX-*
IC3 = ADR444BRZ:ADR444BRZ
IC4 = ADA4841-1YRJZ:ADA4841-1YRJZ
IC5 IC6 = ADA4945-1ACPZ-R7:ADA4945-1ACPZ-R7
IC8 = L79L05ACUTR:L79L05ACUTR
IC9 IC10 = linear:OP27: OP AMP
IC11 = TCA9534ADWR:TCA9534ADWR
L1-L3 = VLS6045AF-101M:VLS6045AF-101M
LED_+3.3V LED_+5V_ADC LED_+5V_FRONTEND LED_-5V_FRONTEND = led:LED: LED OSRAM: - CHIPLED LG R971, LG N971, LY N971, LG Q971, LY Q971, LO R971, LY R971 LH N974, LH R974 LS Q976, LO Q976, LY Q976 LO Q996 - Hyper CHIPLED LW Q18S LB Q993, LB Q99A, LB R99A - SideLED LS A670, LO A670, LY A670, LG A670, LP A670 LB A673, LV A673, LT A673, LW A673 LH A674 LY A675 LS A676, LA A676, LO A676, LY A676, LW A676 LS A679, LY A679, LG A679 - Hyper Micro SIDELED® LS Y876, LA Y876, LO Y876, LY Y876 LT Y87S - SmartLED LW L88C, LW L88S LB L89C, LB L89S, LG L890 LS L89K, LO L89K, LY L89K LS L896, LA L896, LO L896, LY L896 - TOPLED LS T670, LO T670, LY T670, LG T670, LP T670 LSG T670, LSP T670, LSY T670, LOP T670, LYG T670 LG T671, LOG T671, LSG T671 LB T673, LV T673, LT T673, LW T673 LH T674 LS T676, LA T676, LO T676, LY T676, LB T676, LH T676, LSB T676, LW T676 LB T67C, LV T67C, LT T67C, LS T67K, LO T67K, LY T67K, LW E67C LS E67B, LA E67B, LO E67B, LY E67B, LB E67C, LV E67C, LT E67C LW T67C LS T679, LY T679, LG T679 LS T770, LO T770, LY T770, LG T770, LP T770 LB T773, LV T773, LT T773, LW T773 LH T774 LS E675, LA E675, LY E675, LS T675 LS T776, LA T776, LO T776, LY T776, LB T776 LHGB T686 LT T68C, LB T68C - Hyper Mini TOPLED® LB M676 - Mini TOPLED Santana® LG M470 LS M47K, LO M47K, LY M47K Source: http://www.osram.convergy.de LUXEON: - LUMILED® LXK2-PW12-R00, LXK2-PW12-S00, LXK2-PW14-U00, LXK2-PW14-V00 LXK2-PM12-R00, LXK2-PM12-S00, LXK2-PM14-U00 LXK2-PE12-Q00, LXK2-PE12-R00, LXK2-PE12-S00, LXK2-PE14-T00, LXK2-PE14-U00 LXK2-PB12-K00, LXK2-PB12-L00, LXK2-PB12-M00, LXK2-PB14-N00, LXK2-PB14-P00, LXK2-PB14-Q00 LXK2-PR12-L00, LXK2-PR12-M00, LXK2-PR14-Q00, LXK2-PR14-R00 LXK2-PD12-Q00, LXK2-PD12-R00, LXK2-PD12-S00 LXK2-PH12-R00, LXK2-PH12-S00 LXK2-PL12-P00, LXK2-PL12-Q00, LXK2-PL12-R00 Source: www.luxeon.com KINGBRIGHT: KA-3528ASYC Source: www.kingbright.com
LED_SHORT_CH1 LED_SHORT_CH2 = 113-305-04:113-305-04
OSC1 = SG-210STF-32.7680ML3:SG-210STF-32.7680ML3
PCB_BRACKET = 60807-011:60807-011
POT1 POT2 = 3296W:3296W
R1-R32 = RCL:R-EU_: RESISTOR, European symbol; SPICEPREFIX: R
RD = MAX4820EUP+:MAX4820EUP+
RELAY1 RELAY2 = 5-1462037-8:5-1462037-8
SJ1-SJ3 = JUMPER:SJ2W: SMD solder JUMPER
TP_ADC_NRESET TP_GND1-TP_GND4 TP_I2C_NINT TP_I2C_SCL TP_I2C_SDA TP_RD_NCS TP_RD_NRESET TP_SPI_CONFIG_ADC_NCS TP_SPI_CONFIG_CLK TP_SPI_CONFIG_MISO TP_SPI_CONFIG_MOSI TP_SPI_DATA_CLK TP_SPI_DATA_MOSI TP_SPI_DATA_NCS = RSPRO-1MM-TERMINAL-POST-2622034:RSPRO-1MM-TERMINAL-POST-2622034

## Board
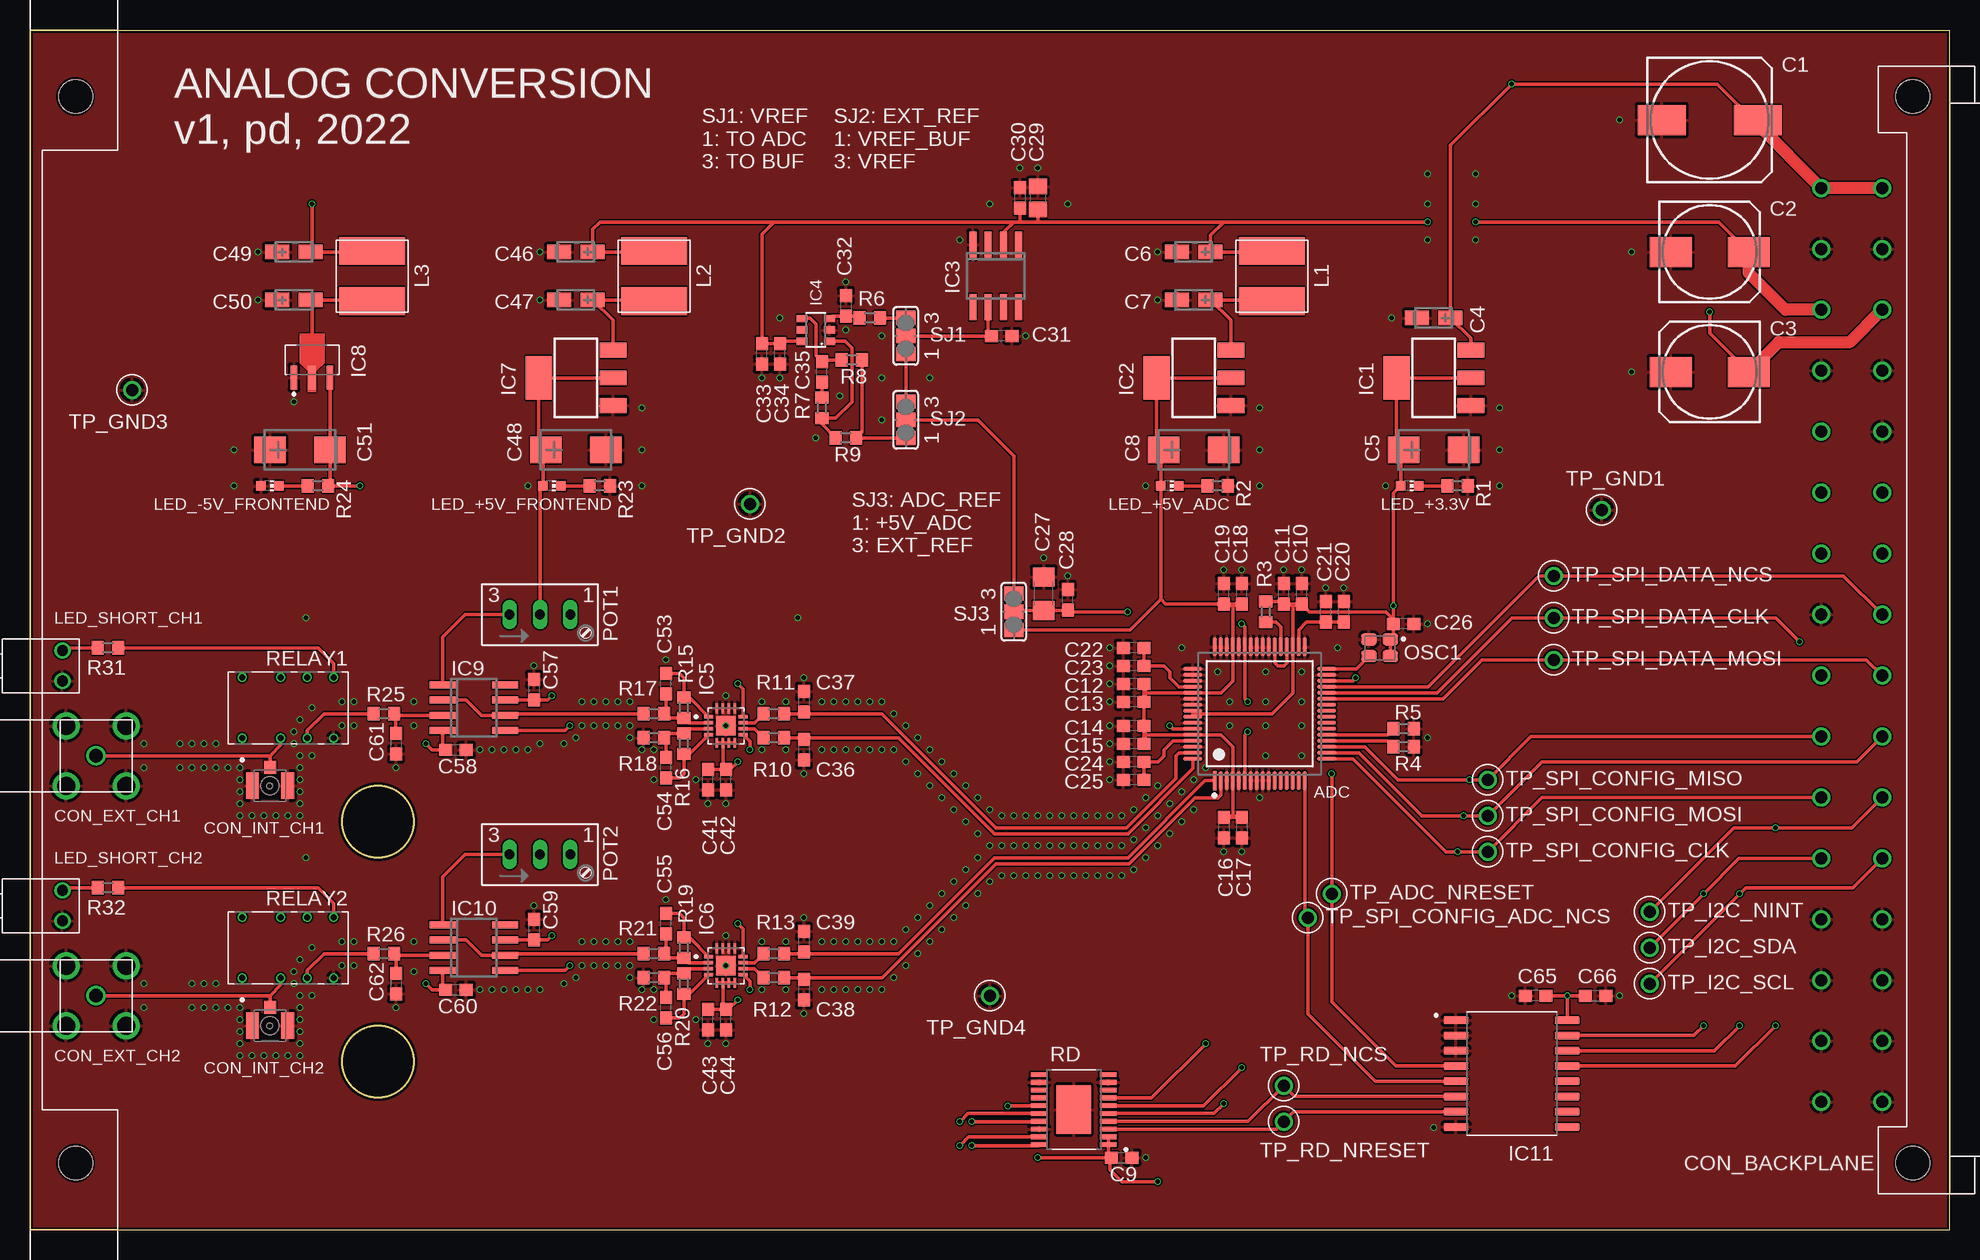
[diagram p6: board, top side]
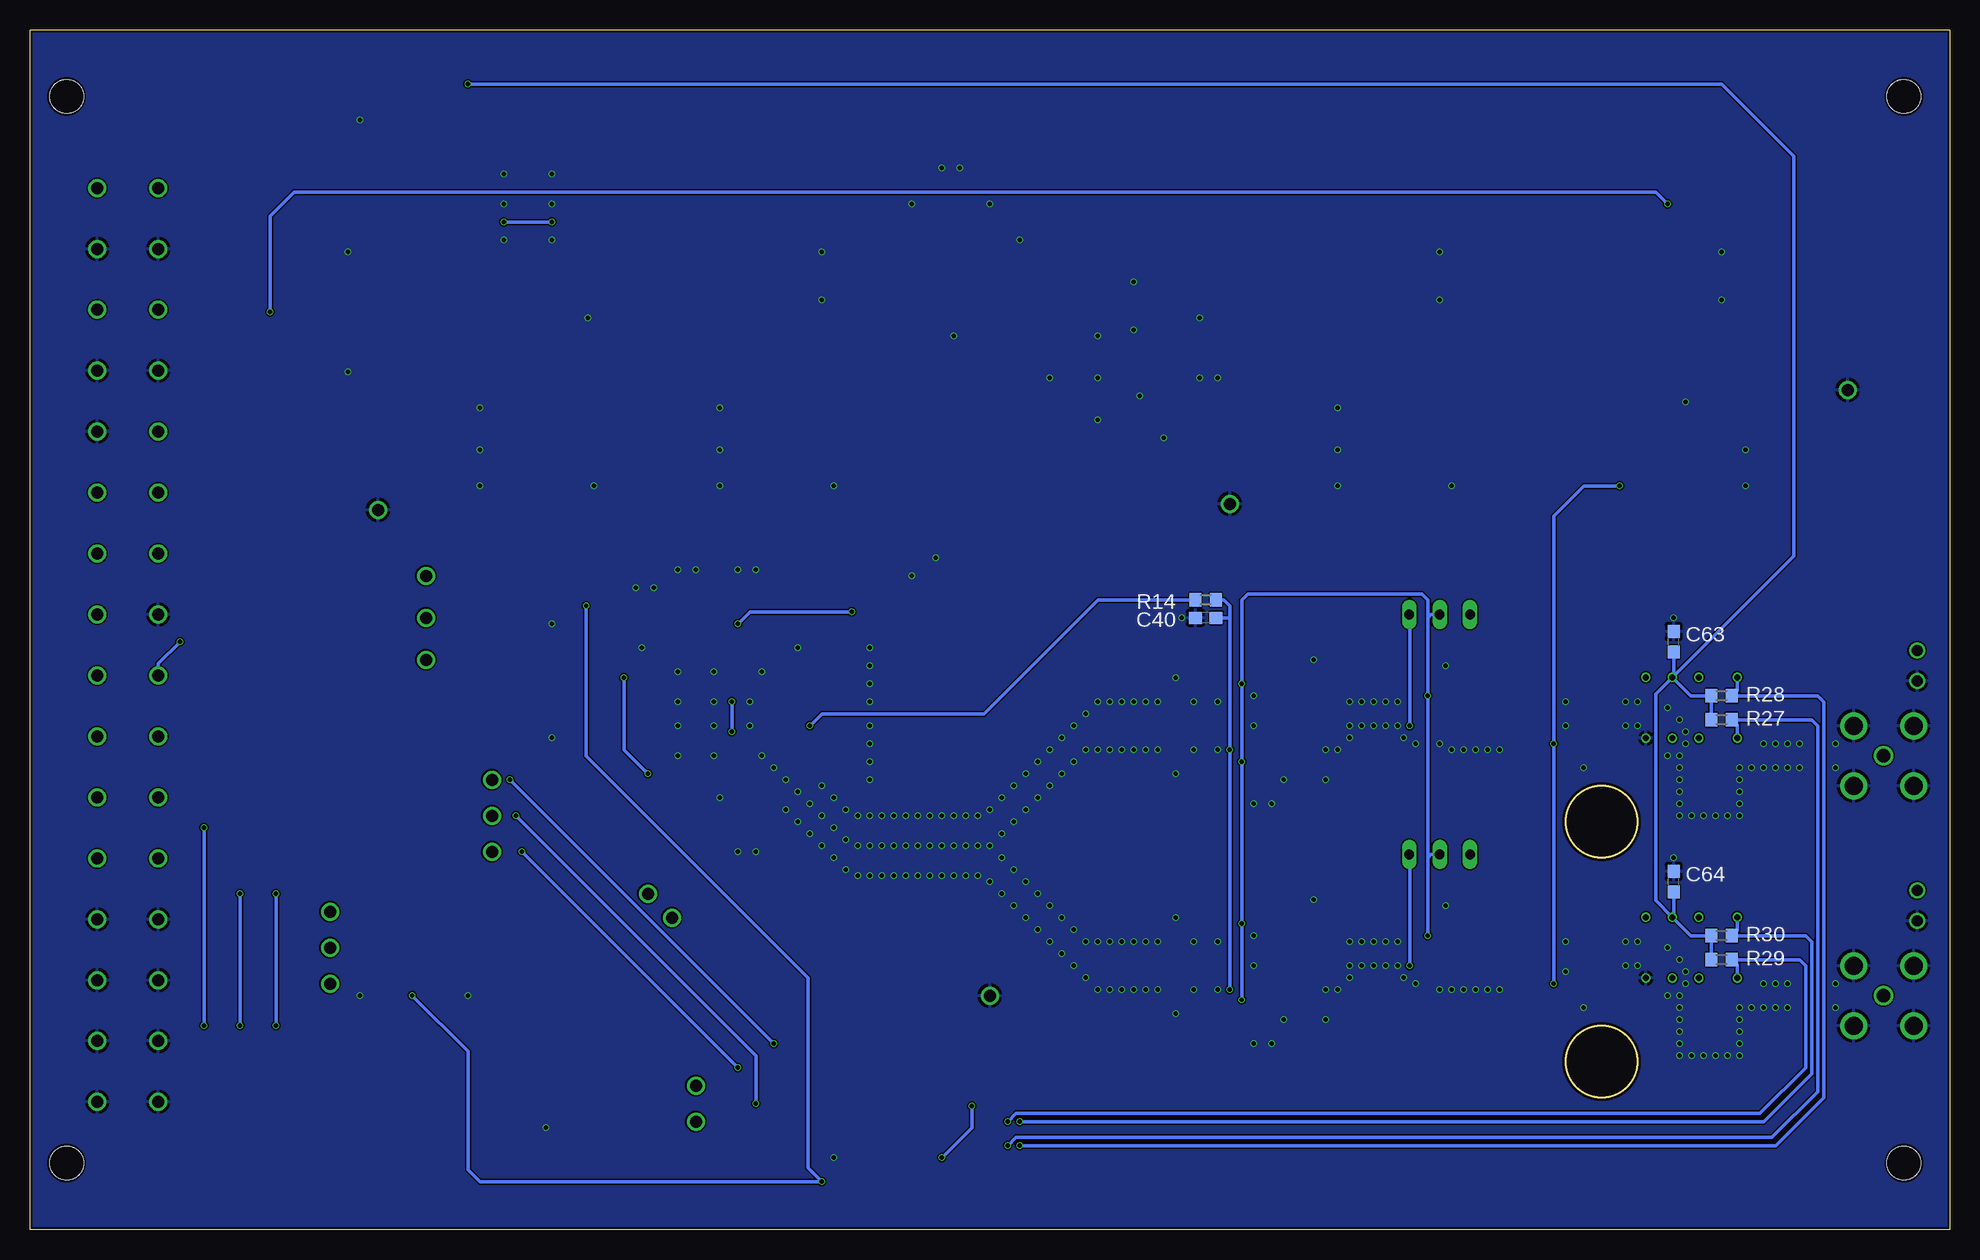
[diagram p7: board, bottom side, seen from below]

Size 160 x 100 mm. Coordinates in mm from the lower left corner, seen from the top.
Outline: 0,0 160,0 160,100 0,100 0,0
Outline: circle at 29,34 radius 3
Outline: circle at 29,14 radius 3
Copper layers (1*16): Top 0.035559375mm / dielectric 1.6mm / Bottom 0.035559375mm
Design rules "jlcpcb2layer": minimum track width 5mil, minimum drill 12mil, track to track 5mil, track to pad 5mil, pad to pad 5mil, via to via 5mil, smd to smd 5mil, copper to edge 8mil, drill to drill 6mil, minimum pad ring 5mil, minimum via ring 3mil, stop-mask expansion 2.5mil, vias tented up to drill 0mil, thermal gap 10mil

### Footprints (pad centres in the part's own frame; a part is rotated, then mirrored left to right if it is on the bottom)
AD7768-4BSTZ = smd 1.6 x 0.312: 1 -5.575,3.75; 2 -5.575,3.25; 3 -5.575,2.75; 4 -5.575,2.25; 5 -5.575,1.75; 6 -5.575,1.25; 7 -5.575,0.75; 8 -5.575,0.25; 9 -5.575,-0.25; 10 -5.575,-0.75; 11 -5.575,-1.25; 12 -5.575,-1.75; 13 -5.575,-2.25; 14 -5.575,-2.75; 15 -5.575,-3.25; 16 -5.575,-3.75; 33 5.575,-3.75; 34 5.575,-3.25; 35 5.575,-2.75; 36 5.575,-2.25; 37 5.575,-1.75; 38 5.575,-1.25; 39 5.575,-0.75; 40 5.575,-0.25; 41 5.575,0.25; 42 5.575,0.75; 43 5.575,1.25; 44 5.575,1.75; 45 5.575,2.25; 46 5.575,2.75; 47 5.575,3.25; 48 5.575,3.75 | smd 0.312 x 1.6: 17 -3.75,-5.575; 18 -3.25,-5.575; 19 -2.75,-5.575; 20 -2.25,-5.575; 21 -1.75,-5.575; 22 -1.25,-5.575; 23 -0.75,-5.575; 24 -0.25,-5.575; 25 0.25,-5.575; 26 0.75,-5.575; 27 1.25,-5.575; 28 1.75,-5.575; 29 2.25,-5.575; 30 2.75,-5.575; 31 3.25,-5.575; 32 3.75,-5.575; 49 3.75,5.575; 50 3.25,5.575; 51 2.75,5.575; 52 2.25,5.575; 53 1.75,5.575; 54 1.25,5.575; 55 0.75,5.575; 56 0.25,5.575; 57 -0.25,5.575; 58 -0.75,5.575; 59 -1.25,5.575; 60 -1.75,5.575; 61 -2.25,5.575; 62 -2.75,5.575; 63 -3.25,5.575; 64 -3.75,5.575
153CLV-1010 = smd 4 x 2.5: + 4,0; - -4,0
153CLV-0810 = smd 3.5 x 2.5: + 3.25,0; - -3.25,0
CT3216 = smd 2 x 1.2: + -1.4,0; - 1.4,0
CT6032 = smd 2.6 x 2.2: + -2.5,0; - 2.5,0
C0603 = smd 1.1 x 1: 1 -0.85,0; 2 0.85,0
C1206 = smd 1.6 x 1.8: 1 -1.4,0; 2 1.4,0
C0805 = smd 1.3 x 1.5: 1 -0.95,0; 2 0.95,0
09031326921 = drill 1: 1 36.83,10.7; 2 36.83,5.62; 3 31.75,10.7; 4 31.75,5.62; 5 26.67,10.7; 6 26.67,5.62; 7 21.59,10.7; 8 21.59,5.62; 9 16.51,10.7; 10 16.51,5.62; 11 11.43,10.7; 12 11.43,5.62; 13 6.35,10.7; 14 6.35,5.62; 15 1.27,10.7; 16 1.27,5.62; 17 -3.81,10.7; 18 -3.81,5.62; 19 -8.89,10.7; 20 -8.89,5.62; 21 -13.97,10.7; 22 -13.97,5.62; 23 -19.05,10.7; 24 -19.05,5.62; 25 -24.13,10.7; 26 -24.13,5.62; 27 -29.21,10.7; 28 -29.21,5.62; 29 -34.29,10.7; 30 -34.29,5.62; 31 -39.37,10.7; 32 -39.37,5.62 | hole 2.8: -44.45,3.05; 44.45,3.05
DELOCK_65848 = drill 1.5: G1 -2.5,2.5; G2 2.5,2.5; G3 -2.5,-2.5; G4 2.5,-2.5 | drill 1.1: S 0,0
2337019-1 = smd 1.05 x 2.2: G1 1.475,0; G2 -1.475,0 | smd 1 x 1.05: S 0,-1.525
SOT223 = smd 2.235 x 1.219: 1 -3.099,2.311; 2 -3.099,0; 3 -3.099,-2.311 | smd 2.2 x 3.6: TAB 3.099,0
ADR444BRZ = smd 0.6 x 2.2: 1 -1.905,-2.6; 2 -0.635,-2.6; 3 0.635,-2.6; 4 1.905,-2.6; 5 1.905,2.6; 6 0.635,2.6; 7 -0.635,2.6; 8 -1.905,2.6
ADA4841-1YRJZ = smd 0.6 x 0.9: 1 -0.95,-1.15; 2 0,-1.15; 3 0.95,-1.15; 4 0.95,1.15; 5 0,1.15; 6 -0.95,1.15
ADA4945-1ACPZ-R7 = smd 0.84 x 0.26: 1 -1.435,0.75; 2 -1.435,0.25; 3 -1.435,-0.25; 4 -1.435,-0.75; 9 1.435,-0.75; 10 1.435,-0.25; 11 1.435,0.25; 12 1.435,0.75 | smd 0.26 x 0.84: 5 -0.75,-1.435; 6 -0.25,-1.435; 7 0.25,-1.435; 8 0.75,-1.435; 13 0.75,1.435; 14 0.25,1.435; 15 -0.25,1.435; 16 -0.75,1.435 | smd 1.6 x 1.6: 17 0,0
L79L05ACUTR = smd 2 x 0.57: 1 -1.475,1.5; 3 -1.475,-1.5 | smd 2 x 0.65: 2 -1.475,0
SO08 = smd 0.6 x 2.2: 1 -1.905,-2.6; 2 -0.635,-2.6; 3 0.635,-2.6; 4 1.905,-2.6; 5 1.905,2.6; 6 0.635,2.6; 7 -0.635,2.6; 8 -1.905,2.6
TCA9534ADWR = smd 2.06 x 0.6: 1 -4.64,4.445; 2 -4.64,3.175; 3 -4.64,1.905; 4 -4.64,0.635; 5 -4.64,-0.635; 6 -4.64,-1.905; 7 -4.64,-3.175; 8 -4.64,-4.445; 9 4.64,-4.445; 10 4.64,-3.175; 11 4.64,-1.905; 12 4.64,-0.635; 13 4.64,0.635; 14 4.64,1.905; 15 4.64,3.175; 16 4.64,4.445
VLS6045AF-101M = smd 2.3 x 5.5: 1 -2.1,0; 2 2.1,0
CHIP-LED0603 = smd 0.8 x 0.8: A 0,-0.75; C 0,0.75
113-305-04 = drill 0.9: + -1.27,0; - 1.27,0
SG-210STF-32.7680ML3 = smd 1.3 x 1: 1 -0.89,-0.69; 2 0.89,-0.69; 3 0.89,0.69; 4 -0.89,0.69
60807-011 = hole 2.8: 0,44.45; 0,-44.45
3296W = drill 0.813 long: 1 2.54,1.27; 2 0,1.27; 3 -2.54,1.27
R0603 = smd 1 x 1.1: 1 -0.85,0; 2 0.85,0
MAX4820EUP+ = smd 1.48 x 0.41: 1 -2.875,2.925; 2 -2.875,2.275; 3 -2.875,1.625; 4 -2.875,0.975; 5 -2.875,0.325; 6 -2.875,-0.325; 7 -2.875,-0.975; 8 -2.875,-1.625; 9 -2.875,-2.275; 10 -2.875,-2.925; 11 2.875,-2.925; 12 2.875,-2.275; 13 2.875,-1.625; 14 2.875,-0.975; 15 2.875,-0.325; 16 2.875,0.325; 17 2.875,0.975; 18 2.875,1.625; 19 2.875,2.275; 20 2.875,2.925 | smd 2.84 x 4.04: 21 0,0
5-1462037-8 = drill 0.5: 1 -2.54,3.8; 2 -2.54,0.6; 3 -2.54,-1.6; 4 -2.54,-3.8; 5 2.54,-3.8; 6 2.54,-1.6; 7 2.54,0.6; 8 2.54,3.8
SJ_2 = smd 1.168 x 1.6: 1 -1.524,0; 2 0,0; 3 1.524,0
RSPRO-1MM-TERMINAL-POST-2622034 = drill 1: P$1 0,0

### Placement (x,y rotation side)
ADC  102.5,43 90 top
C1  140,92.5 0 top
C2  140,81.5 0 top
C3  140,71.5 180 top
C4  117,76 180 top
C5  117,65 0 top
C6  97,81.5 180 top
C7  97,77.5 180 top
C8  97,65 0 top
C9  91,6 0 top
C10  106,53 90 top
C11  104.5,53 90 top
C12  92,45.5 180 top
C13  92,44 180 top
C14  92,42 180 top
C15  92,40.5 180 top
C16  99.5,33.5 270 top
C17  101,33.5 270 top
C18  101,53 90 top
C19  99.5,53 90 top
C20  109.5,51.5 90 top
C21  108,51.5 90 top
C22  92,48.5 180 top
C23  92,47 180 top
C24  92,39 180 top
C25  92,37.5 180 top
C26  114.5,50.5 180 top
C27  84.5,53 90 top
C28  86.5,52.5 90 top
C29  84,86 270 top
C30  82.5,86 270 top
C31  81,74.5 180 top
C32  68,77 270 top
C33  61,73 90 top
C34  62.5,73 90 top
C35  66,71.5 90 top
C36  64.5,40 270 top
C37  64.5,44 270 top
C38  64.5,20 270 top
C39  64.5,24 270 top
C40  62,51 180 bottom
C41  56.5,37.5 90 top
C42  58,37.5 90 top
C43  56.5,17.5 90 top
C44  58,17.5 90 top
C46  45.5,81.5 180 top
C47  45.5,77.5 180 top
C48  45.5,65 0 top
C49  22,81.5 0 top
C50  22,77.5 0 top
C51  22.5,65 0 top
C53  53,45.5 90 top
C54  53,38.5 90 top
C55  53,25.5 90 top
C56  53,18.5 90 top
C57  42,45 270 top
C58  35.5,40 0 top
C59  42,25 270 top
C60  35.5,20 0 top
C61  30.5,40.5 270 top
C62  30.5,20.5 270 top
C63  23,49 90 bottom
C64  23,29 90 bottom
C65  125.5,19.5 180 top
C66  130.5,19.5 0 top
CON_BACKPLANE  160,50 90 top
CON_EXT_CH1  5.5,39.5 0 top
CON_EXT_CH2  5.5,19.5 0 top
CON_INT_CH1  20,37 180 top
CON_INT_CH2  20,17 180 top
IC1  117,71 180 top
IC2  97,71 180 top
IC3  80.5,79.5 180 top
IC4  65.5,75 90 top
IC5  58,42 0 top
IC6  58,22 0 top
IC7  45.5,71 180 top
IC8  23.5,72.5 90 top
IC9  37,43.5 270 top
IC10  37,23.5 270 top
IC11  123.5,13 0 top
L1  103.5,79.5 270 top
L2  52,79.5 270 top
L3  28.5,79.5 90 top
LED_+3.3V  115,62 270 top
LED_+5V_ADC  95,62 270 top
LED_+5V_FRONTEND  43.5,62 270 top
LED_-5V_FRONTEND  20,62 270 top
LED_SHORT_CH1  2.7,47 270 top
LED_SHORT_CH2  2.7,27 270 top
OSC1  112.5,48.5 180 top
PCB_BRACKET  3.8,50 0 top
POT1  42.5,50 0 top
POT2  42.5,30 0 top
R1  119,62 0 top
R2  99,62 0 top
R3  103,51.5 270 top
R4  114.5,40.25 180 top
R5  114.5,41.75 180 top
R6  70,76 180 top
R7  66,68.5 270 top
R8  68.5,72.5 0 top
R9  68,66 0 top
R10  62,41 180 top
R11  62,43 180 top
R12  62,21 180 top
R13  62,23 180 top
R14  62,52.5 0 bottom
R15  54.5,43.5 270 top
R16  54.5,40.5 90 top
R17  52,43 180 top
R18  52,41 180 top
R19  54.5,23.5 270 top
R20  54.5,20.5 90 top
R21  52,23 180 top
R22  52,21 180 top
R23  47.5,62 0 top
R24  24,62 0 top
R25  29.5,43 180 top
R26  29.5,23 180 top
R27  19,42.5 180 bottom
R28  19,44.5 180 bottom
R29  19,22.5 180 bottom
R30  19,24.5 180 bottom
R31  6.5,48.5 180 top
R32  6.5,28.5 180 top
RD  87,10 180 top
RELAY1  21.5,43.5 90 top
RELAY2  21.5,23.5 90 top
SJ1  73,74.5 90 top
SJ2  73,67.5 90 top
SJ3  82,51.5 90 top
TP_ADC_NRESET  108.5,28 0 top
TP_GND1  131,60 0 top
TP_GND2  60,60.5 180 top
TP_GND3  8.5,70 180 top
TP_GND4  80,19.5 180 top
TP_I2C_NINT  135,26.5 0 top
TP_I2C_SCL  135,20.5 0 top
TP_I2C_SDA  135,23.5 0 top
TP_RD_NCS  104.5,12 0 top
TP_RD_NRESET  104.5,9 0 top
TP_SPI_CONFIG_ADC_NCS  106.5,26 0 top
TP_SPI_CONFIG_CLK  121.5,31.5 0 top
TP_SPI_CONFIG_MISO  121.5,37.5 0 top
TP_SPI_CONFIG_MOSI  121.5,34.5 0 top
TP_SPI_DATA_CLK  127,51 0 top
TP_SPI_DATA_MOSI  127,47.5 0 top
TP_SPI_DATA_NCS  127,54.5 0 top

### Tracks (layer width: path | path; a pad name or v marks a point on that pad's centre or on a via)
+3V3  (via drill 0.35)
  Top 0.305: OSC1.4 OSC1.1 113.65,49.45 C26.2 | 105,52.15 C11.1 104.3,52.35 R3.1 | 105,52.15 105.5,52.15 | 105.5,52.15 C10.1 106.65,51.5 113,51.5 113.65,50.85 C26.2 | 105.25,51.9 105,52.15 | 105.25,51.9 ADC.35 105.25,44.75 103.5,43 96.92,43 | 105.25,51.9 105.5,52.15 | ADC.56 96.92,43 | 96.92,43 ADC.57 | C26.2 v113.65,52 113.65,61.4 LED_+3.3V.A 114.25,64.75 | 114.25,64.75 C5.+ | RD.15 81.53,10.32 v81.5,10.3 | v84,6 90,6 | 90,6 C9.1 | RD.2 RD.1 89.88,6.12 90,6 | v94,4 91,4 90,5 90,6 | IC11.16 v128.14,19.5 | C65.1 v128.14,19.5 | C66.1 v128.14,19.5 | IC1.2 IC1.TAB 113.9,65.1 114.25,64.75
  Bottom 0.305: v81.5,10.3 81.5,8.5 v84,6 | v113.65,52 113.65,39.5 95.15,21 95.15,5.15 v94,4 122.5,4 123.5,5 123.5,14.86 v128.14,19.5
+5V  (via drill 0.35)
  Top 0.305: IC1.3 120.1,74.3 C4.+ 118.4,90.4 v123.5,95.5 140.63,95.5 144,92.13
  Top 1.016: CON_BACKPLANE.2 CON_BACKPLANE.1 | CON_BACKPLANE.1 149.17,86.83 149,87 149.13,87 CON_BACKPLANE.1 | CON_BACKPLANE.1 144,92.13 C1.+
  Bottom 0.305: RELAY2.6 24.5,27.44 24.5,44.64 RELAY1.6 | RELAY1.6 13,56.14 13,89.5 19,95.5 v123.5,95.5 | RELAY1.6 23,46.14 C63.1 | RELAY2.6 23,26.14 C64.1 | R29.2 R30.2 21.56,24.5 RELAY2.6 | R27.2 R28.2 21.56,44.5 RELAY1.6
+5V_ADC
  Top 0.305: C18.1 100.5,52.15 | 100.5,52.15 C19.1 | 100.25,51.9 ADC.45 100.25,45.75 99.25,44.75 ADC.53 93.1,44.75 | 100.25,51.9 100.5,52.15 | 100.25,51.9 100,52.15 C19.1 | C16.1 100,34.35 | 100,34.35 100.5,34.35 | 100.5,34.35 C17.1 | 100.25,34.6 ADC.4 100.25,40.25 99.25,41.25 ADC.60 93.1,41.25 | 100.25,34.6 100,34.35 | 100.25,34.6 100.5,34.35 | C15.1 92.85,41 | 92.85,41 92.85,41.5 | 92.85,41.5 C14.1 C13.1 | C13.1 92.85,45 | 92.85,45 C12.1 | 93.1,44.75 92.85,45 | 93.1,44.75 92.85,44.5 C13.1 | 92.85,41.5 93.1,41.25 | 93.1,41.25 92.85,41 | C19.1 94.65,52.15 94.25,52.55 | 94.25,64.5 LED_+5V_ADC.A 94.25,52.55 | 94.25,64.5 94.25,64.75 C8.+ | SJ3.1 91.68,49.98 94.25,52.55 | 94.25,64.5 93.9,64.85 IC2.TAB IC2.2
+5V_FRONTEND  (via drill 0.35)
  Top 0.305: IC5.6 IC5.5 | IC5.6 IC5.7 IC5.8 | IC5.12 59.44,45.06 v59,45.5 | C41.2 C42.2 | C42.2 58.35,38.35 v59,39 | IC5.6 57.75,38.6 C42.2 | IC9.7 41.98,44.13 | 41.98,44.13 C57.2 | IC10.7 41.98,24.14 C59.2 43.15,24.15 v43.5,24.5 | IC6.5 IC6.6 | IC6.6 IC6.7 IC6.8 | IC6.12 59.44,25.07 v59,25.5 | C43.2 57.5,18.35 | 57.5,18.35 C44.2 58.2,18.35 v59,19.15 | IC6.6 57.75,18.6 57.5,18.35 | v43.5,44.5 43.13,44.13 41.98,44.13 | POT1.2 42.5,61.75 LED_+5V_FRONTEND.A 42.75,65 C48.+ 42.4,65 IC7.TAB IC7.2
  Bottom 0.305: v59,19.15 v59,25.5 v59,39 v59,45.5 59,52.5 58.5,53 44,53 43.5,52.5 43.5,51 | v43.5,24.5 43.5,31 | 43.5,31 v43.5,44.5 43.5,51 | POT2.2 43.23,31.27 43.5,31 | POT1.2 43.23,51.27 43.5,51
+12V  (via drill 0.35)
  Top 0.305: v120.5,84 140.75,84 C2.+ | v116.5,84 99.5,84 | IC3.2 81.14,83.14 82,84 | 99.5,84 84,84 | 84,84 82.5,84 | 82.5,84 82,84 | C29.2 84,84 | C30.2 82.5,84 | IC4.6 62.7,74.05 C34.2 C33.2 61,83 62,84 | 82,84 62,84 | 99.5,84 98.4,82.9 C6.+ 103.4,81.5 L1.1 | 62,84 47.5,84 46.9,83.4 C46.+ 51.9,81.5 L2.1
  Top 1.016: CON_BACKPLANE.5 146.33,76.67 143.25,79.75 C2.+
  Bottom 0.305: v116.5,84 v120.5,84
-5V_FRONTEND  (via drill 0.35)
  Top 0.305: IC10.4 34.4,20.25 C60.1 33.5,20 v33,20.5 | IC9.4 34.4,40.25 C58.1 33.5,40 v33,40.5 | IC8.3 C51.- 25,62.15 R24.2 v27.5,62
  Bottom 0.305: v33,20.5 v33,40.5 33,59.5 30.5,62 v27.5,62
-12V  (via drill 0.35)
  Top 0.305: C3.- 140,74.75 v140,76.5 | v23.5,85.5 23.5,81.6 C49.- 28.4,81.5 L3.2
  Top 1.016: C3.- 145.75,74 151.71,74 CON_BACKPLANE.6
  Bottom 0.305: v140,76.5 140,84.5 138,86.5 24.5,86.5 v23.5,85.5
ADC_AIN0_N
  Top 0.305: ADC.63 95.75,39.75 95.5,39.5 95.5,37.61 91.39,33.5 80.5,33.5 71,43 64.35,43 | C37.2 64.35,43 | 64.35,43 R11.1
ADC_AIN0_P
  Top 0.305: ADC.64 96.92,38.42 91.5,33 80.39,33 72.39,41 64.65,41 C36.1 64.35,41 R10.1
ADC_AIN1_N
  Top 0.305: ADC.1 97.92,37.42 91.5,31 80.39,31 72.39,23 64.65,23 C39.2 64.35,23 R13.1
ADC_AIN1_P
  Top 0.305: ADC.2 99.25,36.25 99,36 97.11,36 91.61,30.5 80.5,30.5 71,21 64.35,21 | C38.1 64.35,21 | 64.35,21 R12.1
ADC_MCLK
  Top 0.305: ADC.32 110.55,46.75 OSC1.3
ADC_NRESET  (via drill 0.35)
  Top 0.305: IC11.4 113.86,13.63 108.5,19 TP_ADC_NRESET.P$1 v108.5,38 | v110.5,46 110.25,45.75 ADC.30
  Bottom 0.305: v108.5,38 110.5,40 v110.5,46
ADC_REF  (via drill 0.35)
  Top 0.305: v101.5,44 101.25,44.25 ADC.43 101.25,50.25 v101,50.5 | v101.5,41.5 101.25,41.25 ADC.6 | SJ3.2 82.1,51.6 C27.1 86.45,51.6 C28.1 86.65,51.5 v91.5,51.5
  Bottom 0.305: v101.5,44 v101.5,41.5 | v101,50.5 100,51.5 v91.5,51.5
DIN
  Top 0.305: ADC.21 113.15,41.25 R5.2
DREGCAP
  Top 0.305: ADC.34 105.75,50 106.4,50.65 C21.1 C20.1
EXT_REF
  Top 0.305: SJ2.2 79,67.5 82,64.5 SJ3.3
GND  (via drill 0.35)
  other vias: 96,36.5 95,35.5 94,34.5 93,33.5 92,35 95,33 90,37.5 90,39 90,40.5 90,42 90,44 90,45.5 90,47 90,48.5 99.5,31.5 101,31.5 99.5,55 101,55 104.5,55 106,55 108,53.5 109.5,53.5 109,48.5 116.5,50.5 102.5,62 102.5,68.5 102.5,65 94,81.5 133.5,71.5 133.5,81.5 132.5,92.5 122.5,65 122.5,62 122.5,68.5 113.5,76 116.5,82.5 120.5,82.5 120.5,85.5 116.5,85.5 116.5,41 96,48.5 86.5,54.5 84.5,56 99,46.5 100,44 100,42 103,46.5 103,44 103,42 106,46.5 106,44 106,42 106,39.5 99,39.5 98,38.5 103,39.5 84,88.5 82.5,88.5 77.5,82.5 83,74.5 71,71 62.5,76 61,71 62.5,71 67.5,69.5 65.5,66 71,67.5 71,74.5 68,79 75,71 96,34 93,36 91,34.5 97,37.5 94,32 97,35 64.5,26 64.5,46 64.5,18 63,20 61,20 64.5,38 58,22 58,42 93,31 92,30 91,29.5 92,32.5 91,32 90,32 90,34.5 89,34.5 89,32 90,29.5 89,29.5 88,29.5 87,29.5 86,29.5 85,29.5 84,29.5 88,32 87,32 86,32 85,32 84,32 88,34.5 87,34.5 86,34.5 85,34.5 84,34.5 83,34.5 82,34.5 81,34.5 80,35 83,32 82,32 81,32 83,29.5 82,29.5 81,29.5 80,32 80,29 79,28 78,27 77,26 76,25 75,24 74,23 73,22 72,21 71,20 79,36 78,37 77,38 76,39 75,40 74,41 73,42 72,43 71,44 79,31 79,33 78,34 77,35 78,30 77,29 76,28 75,27 74,26 73,25 72,24 71,24 76,36 75,37 74,38 73,39 72,40 71,40 70,44 70,40 70,24 69,24 70,20 69,20 68,24 67,24 66,24 68,20 67,20 66,20 69,44 68,44 67,44 66,44 69,40 68,40 67,40 66,40 63,24 61,24 63,40 61,40 61,44 63,44 58,15.5 58,44.5 58,24.5 56.5,15.5 56.5,35.5 58,35.5 52,37.5 53,47.5 53,27.5 52,17.5 55.5,17.5 55.5,37.5 113,62 93,62 116.5,88 120.5,88 86.5,85.5 80,85.5 94,77.5 42,47 42,27 37.5,20 37.5,40 30.5,38.5 30.5,18.5 50,21 50,41 64,51 46,44 46,42 47,42 47,44 48,44 48,42 49,42 49,44 50,44 50,42 46,24 47,24 48,24 49,24 50,24 46,22 47,22 48,22 49,22 50,22 51,40 51,20 52,20 52,40 42.5,81.5 42.5,77.5 51,68.5 51,65 51,62 41.5,62 19,81.5 19,77.5 17,65 22,69 17,62 94,37 102.5,36 68,75 27,44 27,42 27,24 27,22 23,31 23,51 32,44 32,42 32,24 32,21.5 9.5,40.5 9.5,38.5 13.5,40.5 14.5,40.5 15.5,40.5 13.5,38.5 14.5,38.5 15.5,38.5 16.5,38.5 17.5,38.5 17.5,37.5 17.5,36.5 17.5,35.5 17.5,34.5 18.5,34.5 19.5,34.5 20.5,34.5 21.5,34.5 22.5,34.5 22.5,35.5 22.5,36.5 22.5,37.5 22.5,38.5 22.5,39.5 23.5,39.5 26,42 26,44 9.5,20.5 13.5,20.5 14.5,20.5 15.5,20.5 9.5,18.5 13.5,18.5 14.5,18.5 15.5,18.5 16.5,18.5 17.5,18.5 17.5,17.5 17.5,16.5 17.5,15.5 17.5,14.5 18.5,14.5 19.5,14.5 20.5,14.5 21.5,14.5 22.5,14.5 22.5,15.5 22.5,16.5 22.5,17.5 22.5,18.5 22.5,19.5 23.5,19.5 26,24 26,22 22,21.5 22.5,22.5 23.5,23.5 22,20.5 22,40.5 22,41.5 22.5,42.5 23.5,43.5 38.5,40 39.5,40 40.5,40 41.5,40 42.5,40.5 44.5,40.5 45.5,41 38.5,20 39.5,20 40.5,20 41.5,20 42.5,20 45.5,21 44.5,20.5 12.5,40.5 12.5,38.5 93,6 132.5,19.5 123.5,19.5 117,8.5
  pour Bottom: 0,0 0,100 160,100 160,0
  pour Top: 0,0 0,100 160,100 160,0
I2C_NINT  (via drill 0.35)
  Top 0.305: TP_I2C_NINT.P$1 142,33.5 v145.5,33.5 151.85,33.5 CON_BACKPLANE.22 | IC11.13 142.13,13.63 v145.5,17
  Bottom 0.305: v145.5,17 v145.5,33.5
I2C_SCL  (via drill 0.35)
  Top 0.305: TP_I2C_SCL.P$1 v142.5,28 143,28.5 151.93,28.5 CON_BACKPLANE.24 | IC11.14 140.41,14.9 v142.5,17
  Bottom 0.305: v142.5,17 v142.5,28
I2C_SDA  (via drill 0.35)
  Top 0.305: TP_I2C_SDA.P$1 v139.5,28 142.45,30.95 CON_BACKPLANE.23 | IC11.15 138.68,16.18 v139.5,17
  Bottom 0.305: v139.5,17 v139.5,28
N$1
  Top 0.305: R6.1 72.98,76 SJ1.3
N$2
  Top 0.305: IC4.3 66.85,76.15 C32.2 69,76.15 R6.2
N$3
  Top 0.305: R9.1 66,67.15 R7.2 67.15,67.65 68.5,69 68.5,73.5 67.95,74.05 IC4.1
N$4
  Top 0.305: IC2.3 100.1,75.8 C7.+ 103.4,77.5 L1.2
N$5
  Top 0.305: SJ2.3 SJ1.1
N$6
  Top 0.305: R7.1 C35.1
N$7
  Top 0.305: IC4.4 64.4,76 65,76 65.5,75.5 65.5,72.85 C35.2 66.15,72.5 R8.1
N$8
  Top 0.305: IC6.10 60.4,21.75 R12.2
N$9
  Top 0.305: IC5.10 60.4,41.75 R10.2
N$10
  Top 0.305: IC5.11 60.4,42.25 R11.2
N$11  (via drill 0.35)
  Top 0.305: ADC.59 95.25,41.75 v95,42
  Bottom 0.305: v95,42 94,43 80.5,43 71,52.5 R14.1
N$12
  Top 0.305: LED_+5V_FRONTEND.C R23.1
N$13
  Top 0.305: L2.2 51.9,77.5 C47.+ 48.6,75.8 IC7.3
N$14
  Top 0.305: IC6.11 60.4,22.25 R13.2
N$15
  Top 0.305: L3.1 28.4,77.5 C50.- 23.5,77.4 IC8.2
N$16
  Top 0.305: IC5.2 54.9,42.25 R15.2 53.2,42.65 R17.1 53,43.15 C53.1
N$17
  Top 0.305: IC5.1 54.97,44.35 R15.1 54.5,46 54.15,46.35 C53.2
N$18
  Top 0.305: IC5.4 54.97,39.65 R16.1 54.5,38 54.15,37.65 C54.1
N$19
  Top 0.305: IC5.3 54.9,41.75 R16.2 53.2,41.35 R18.1 53,40.85 C54.2
N$20
  Top 0.305: IC9.3 30.48,42.87 | 30.48,42.87 R25.1 | C61.1 30.48,41.37 30.48,42.87
N$21
  Top 0.305: IC6.2 54.9,22.25 R19.2 53.2,22.65 R21.1 53,23.15 C55.1
N$22
  Top 0.305: IC6.1 54.97,24.35 R19.1 54.5,26 54.15,26.35 C55.2
N$23
  Top 0.305: LED_-5V_FRONTEND.C R24.1
N$24
  Top 0.305: IC6.3 54.9,21.75 R20.2 53.2,21.35 R22.1 53,20.85 C56.2
N$25
  Top 0.305: IC6.4 54.97,19.65 R20.1 54.5,18 54.15,17.65 C56.1
N$26
  Top 0.305: R21.2 39.73,23 IC10.6 37.63,22.86 36.37,24.14 IC10.2
N$27
  Top 0.305: C62.1 30.5,22.85 R26.1 30.48,22.86 IC10.3
N$28
  Top 0.305: R17.2 39.73,43 IC9.6 37.63,42.87 36.37,44.13 IC9.2
N$29
  Top 0.305: R25.2 24.5,43 23.1,41.6 RELAY1.3
N$30
  Top 0.305: R26.2 24.5,23 23.1,21.6 RELAY2.3
N$31
  Top 0.305: IC9.1 34.4,49.4 36.27,51.27 POT1.3
N$32  (via drill 0.35)
  Top 0.305: IC9.5 44.59,41.59 v45,42
  Bottom 0.305: v45,42 45,51.23 POT1.1
N$33
  Top 0.305: IC10.1 34.4,29.4 36.27,31.27 POT2.3
N$34  (via drill 0.35)
  Top 0.305: IC10.5 44.59,21.59 v45,22
  Bottom 0.305: v45,22 45,31.23 POT2.1
N$48
  Top 0.305: ADC.20 113.15,40.75 R4.2
N$49
  Top 0.305: LED_+3.3V.C R1.1
N$50
  Top 0.305: R2.1 LED_+5V_ADC.C
N$54
  Top 0.305: CON_EXT_CH1.S 20,39.5 | RELAY1.2 20.9,40.4 20,39.5 | CON_INT_CH1.S 20,39.5
N$55
  Top 0.305: CON_EXT_CH2.S 20,19.5 | RELAY2.2 20.9,20.4 20,19.5 | CON_INT_CH2.S 20,19.5
N$56
  Top 0.305: LED_SHORT_CH1.+ 2.93,48.5 R31.2
N$58
  Top 0.305: R32.2 2.93,28.5 LED_SHORT_CH2.+
N$59
  Top 0.305: R32.1 24,28.5 25.3,27.2 RELAY2.5
N$60
  Top 0.305: R31.1 24,48.5 25.3,47.2 RELAY1.5
N$78
  Top 0.305: ADC.38 103.75,47.25 104,47 104.5,47 104.75,47.25 ADC.36
N$81
  Top 0.305: R3.2 103.85,50.65 104.25,50.25 ADC.37
RD_NCS
  Top 0.305: IC11.6 105.41,11.1 TP_RD_NCS.P$1 101.53,9.03 RD.4
RD_NRESET
  Top 0.305: IC11.7 105.33,9.82 TP_RD_NRESET.P$1 103.88,8.38 RD.3
RD_OUT1  (via drill 0.35)
  Top 0.305: RD.20 84.05,7 v78.5,7
  Bottom 0.305: RELAY1.1 17.7,42.05 R27.1 11.5,42.5 11,42 11,11.5 14.8,7.7 77.8,7.7 v78.5,7
RD_OUT2  (via drill 0.35)
  Top 0.305: v77.5,7 78.22,7.72 RD.19
  Bottom 0.305: RELAY1.8 17.7,44.95 R28.1 11,44.5 10.5,44 10.5,11 14.5,7 v77.5,7
RD_OUT3  (via drill 0.35)
  Top 0.305: RD.17 84.1,9 v78.5,9
  Bottom 0.305: RELAY2.1 17.7,22.05 R29.1 12.5,22.5 12,22 12,13.5 15.8,9.7 77.8,9.7 v78.5,9
RD_OUT4  (via drill 0.35)
  Top 0.305: v77.5,9 78.17,9.68 RD.16
  Bottom 0.305: RELAY2.8 17.7,24.95 R30.1 12,24.5 11.5,24 11.5,13 15.5,9 v77.5,9
REGCAPA
  Top 0.305: C25.1 C24.1 94,39 94.5,39.5 94.5,40 95.25,40.75 ADC.61
REGCAPB
  Top 0.305: C22.1 C23.1 94.5,47 95,46.5 95,46 95.75,45.25 ADC.52
SPI_CONFIG_ADC_NCS
  Top 0.305: IC11.5 112.14,12.37 106.5,18 TP_SPI_CONFIG_ADC_NCS.P$1 106.25,26.25 ADC.16
SPI_CONFIG_CLK  (via drill 0.35)
  Top 0.305: RD.6 97.83,10.32 v101,13.5 | ADC.17 110.25,39.25 118,31.5 v119,31.5 TP_SPI_CONFIG_CLK.P$1 126.03,36.03 CON_BACKPLANE.21
  Bottom 0.305: v101,13.5 v119,31.5
SPI_CONFIG_MISO  (via drill 0.35)
  Top 0.305: RD.7 93.47,10.97 v98,15.5 | ADC.19 111.25,40.25 114,37.5 v120,37.5 TP_SPI_CONFIG_MISO.P$1 125.11,41.11 CON_BACKPLANE.19
  Bottom 0.305: v98,15.5 v120,37.5
SPI_CONFIG_MOSI  (via drill 0.35)
  Top 0.305: ADC.18 110.75,39.75 116,34.5 v119.5,34.5 TP_SPI_CONFIG_MOSI.P$1 126,39 152.27,39 CON_BACKPLANE.20 | RD.5 98.67,9.68 v99.5,10.5
  Bottom 0.305: v99.5,10.5 99.5,14.5 v119.5,34.5
SPI_DATA_CLK  (via drill 0.35)
  Top 0.305: ADC.28 117.25,44.75 123.5,51 TP_SPI_DATA_CLK.P$1 145.5,51 v147.5,49
  Bottom 0.305: v147.5,49 149.3,47.2 CON_BACKPLANE.17
SPI_DATA_MOSI
  Top 0.305: CON_BACKPLANE.18 153.07,47.5 TP_SPI_DATA_MOSI.P$1 121,47.5 117.75,44.25 ADC.27
SPI_DATA_NCS
  Top 0.305: ADC.29 116.5,45.25 125.75,54.5 TP_SPI_DATA_NCS.P$1 151.15,54.5 CON_BACKPLANE.16
VCM  (via drill 0.35)
  Top 0.305: IC5.9 60,40.69 v60,40 | IC6.9 60,20.68 v60,20
  Bottom 0.305: v60,20 v60,40 60,51 | R14.2 60.5,52.5 60,52 60,51 | C40.1 60,51
VREF
  Top 0.305: IC3.6 79.86,74.78 C31.2 SJ1.2
VREF_BUF
  Top 0.305: R9.2 68.92,66.08 | 68.92,66.08 69.35,66.5 R8.2 | SJ2.1 69.02,65.98 68.92,66.08

### Text on the board
tPlace: SJ1: VREF / 1: TO ADC / 3: TO BUF | SJ2: EXT_REF / 1: VREF_BUF / 3: VREF | ANALOG CONVERSION / v1, pd, 2022 | 3 | 1 | 3 | 1 | SJ3: ADC_REF / 1: +5V_ADC / 3: EXT_REF | 3 | 1